# EAGLE design multiout4 (EAGLE 4.16)

## Sheet 1 of 2
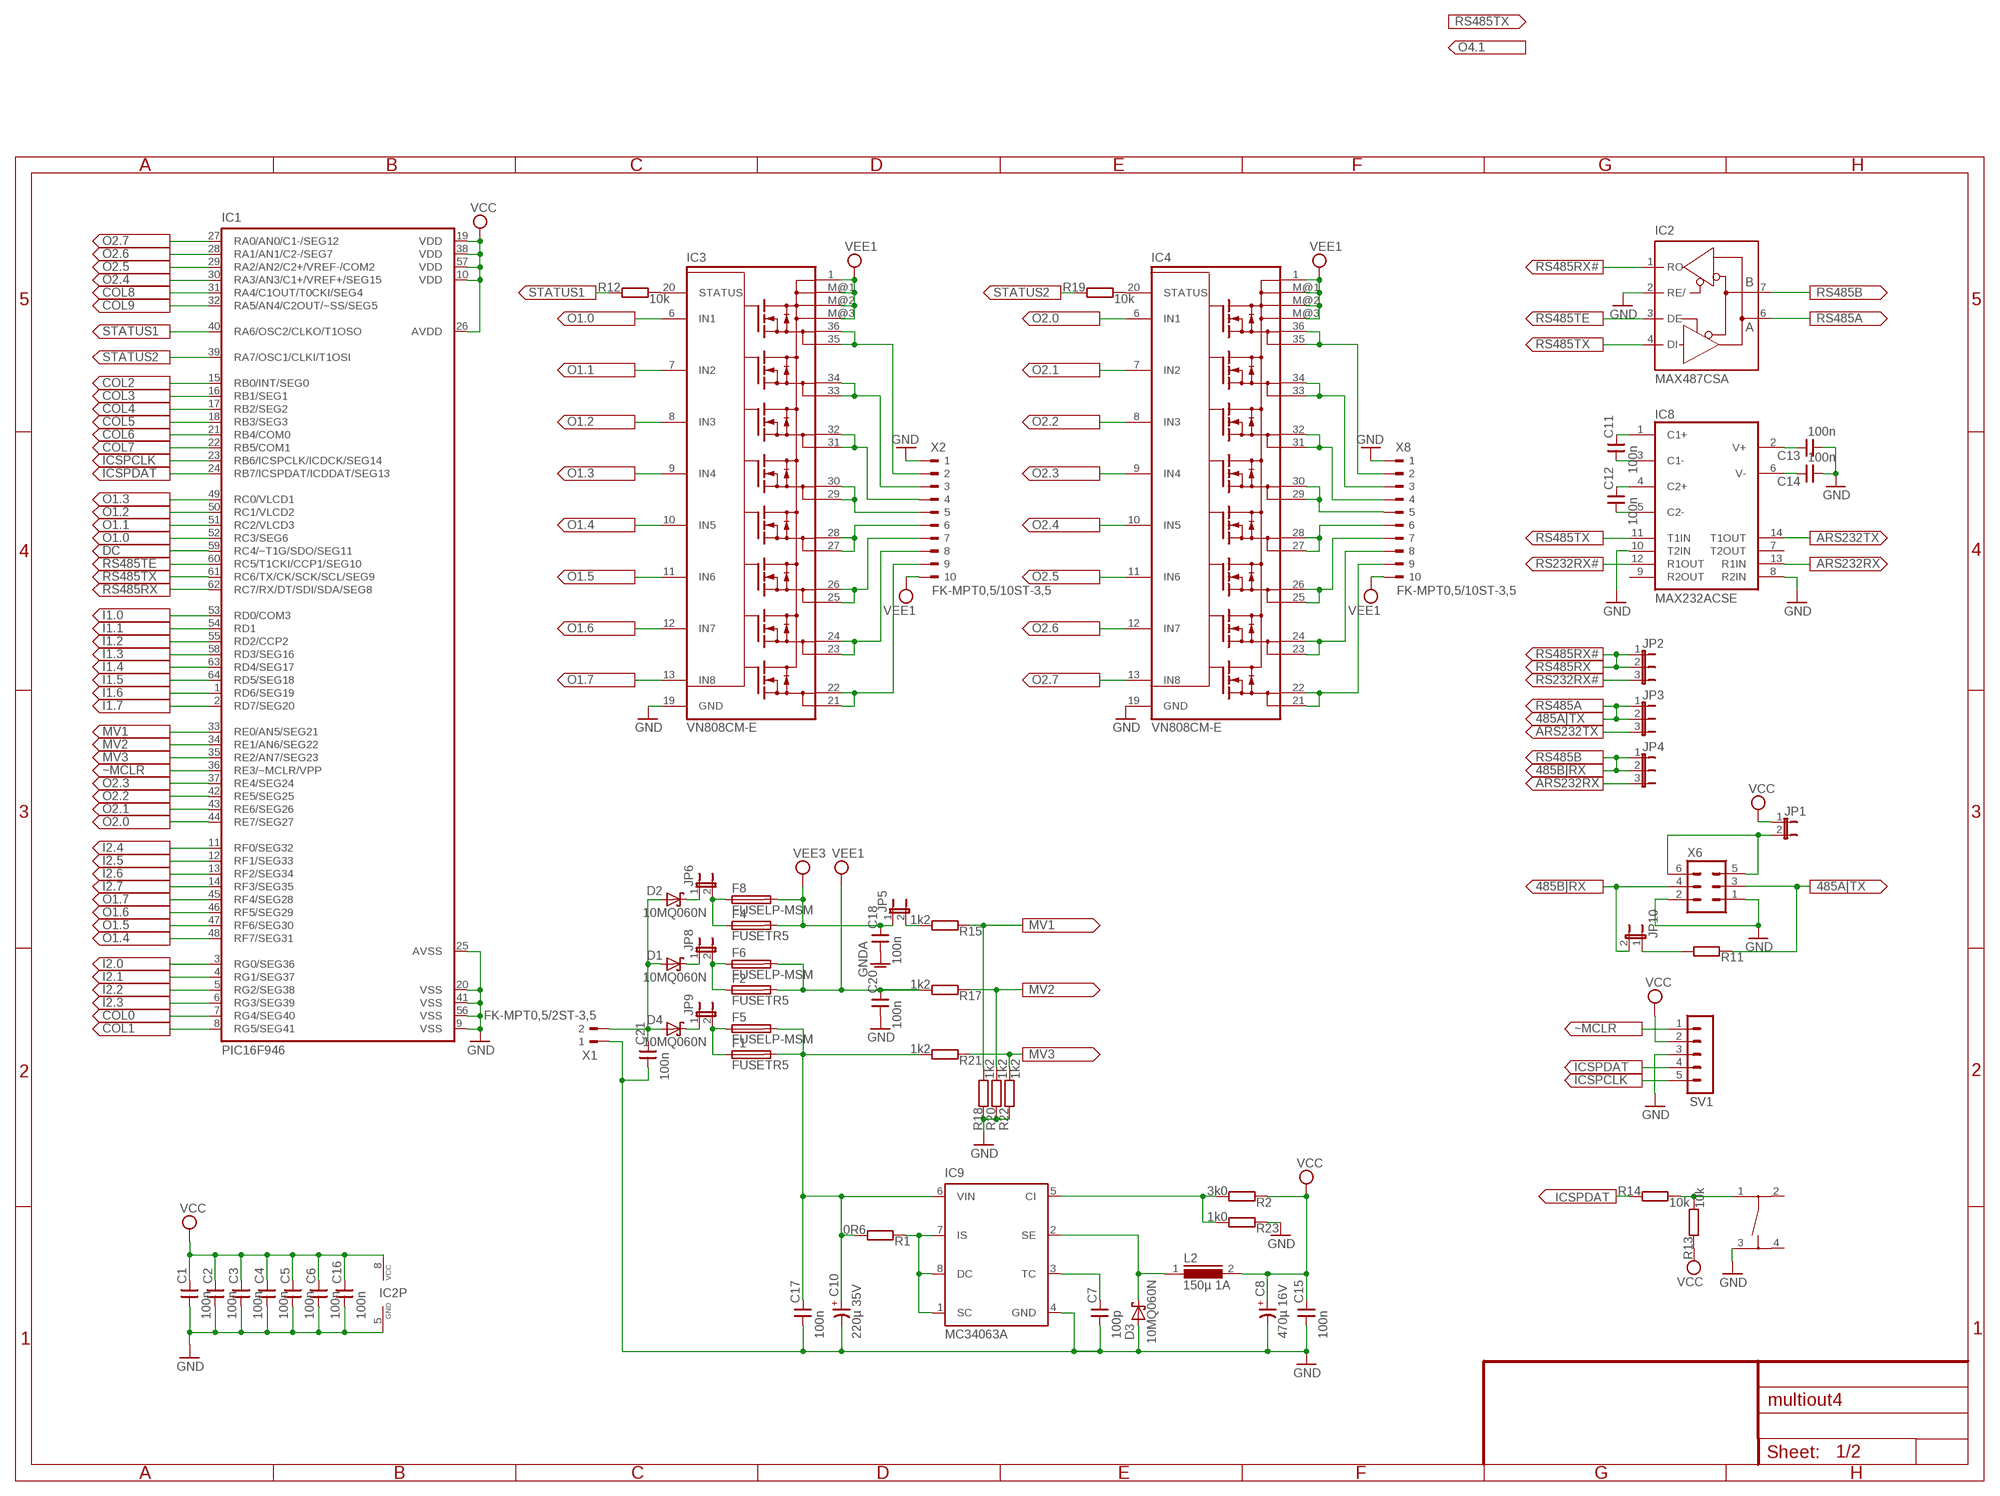
[diagram p0: schematic, sheet 1]

### Parts
C1  100n  CNP-1206  [1206]
C2  100n  CNP-1206  [1206]
C3  100n  CNP-1206  [1206]
C4  100n  CNP-1206  [1206]
C5  100n  CNP-1206  [1206]
C6  100n  CNP-1206  [1206]
C7  100p  CNP-0805  [0805]
C8  470µ 16V  CP-E-035X080  [E-035X080]
C10  220µ 35V  CP-E-035X080  [E-035X080]
C11  100n  CNP-1206  [1206]
C12  100n  CNP-1206  [1206]
C13  100n  CNP-1206  [1206]
C14  100n  CNP-1206  [1206]
C15  100n  CNP-1206  [1206]
C16  100n  CNP-1206  [1206]
C17  100n  CNP-1206  [1206]
C18  100n  CNP-1206  [1206]
C20  100n  CNP-1206  [1206]
C21  100n  CNP-1206  [1206]
D1  10MQ060N  SCHOTTKY-DIODESMA  [SMA]
D2  10MQ060N  SCHOTTKY-DIODESMA  [SMA]
D3  10MQ060N  SCHOTTKY-DIODESMA  [SMA]
D4  10MQ060N  SCHOTTKY-DIODESMA  [SMA]
F1  FUSETR5  [TR5]
F2  FUSETR5  [TR5]
F4  FUSETR5  [TR5]
F5  FUSELP-MSM  [LP-MSM]
F6  FUSELP-MSM  [LP-MSM]
F8  FUSELP-MSM  [LP-MSM]
IC1  PIC16F946  [TQFP64_10X10]
IC2  MAX487CSA  MAX481CSA  [SO08]
IC3  VN808CM-E  [PSO36]
IC4  VN808CM-E  [PSO36]
IC8  MAX232ACSE  [SO16]
IC9  MC34063A  LM34063AS08  [SO08]
JP1  JP1EI  [JP1]
JP2  JP2ES  [SJ_2]
JP3  JP2ES  [SJ_2]
JP4  JP2ES  [SJ_2]
JP5  JP1EI  [JP1]
JP6  JP1EI  [JP1]
JP8  JP1EI  [JP1]
JP9  JP1EI  [JP1]
JP10  JP1EI  [JP1]
L2  150µ 1A  PISM  [PISM]
R1  0R6  R-EU_R0805  [R0805]
R2  3k0  R-EU_R0805  [R0805]
R11  R-EU_R0805  [R0805]
R12  10k  R-EU_R0805  [R0805]
R13  10k  R-EU_R0805  [R0805]
R14  10k  R-EU_R0805  [R0805]
R15  1k2  R-EU_R0805  [R0805]
R17  1k2  R-EU_R0805  [R0805]
R18  1k2  R-EU_R0805  [R0805]
R19  10k  R-EU_R0805  [R0805]
R20  1k2  R-EU_R0805  [R0805]
R21  1k2  R-EU_R0805  [R0805]
R22  1k2  R-EU_R0805  [R0805]
R23  1k0  R-EU_R0805  [R0805]
SV1  MA05-1  [MA05-1]
U$3  MENTOR1254  [1254.1004]
X1  FK-MPT0,5/2ST-3,5  [FK-MPT0,5/2ST-3,5]
X2  FK-MPT0,5/10ST-3,5  [FK-MPT0,5/10ST-3,5]
X6  ML6  [ML6]
X8  FK-MPT0,5/10ST-3,5  [FK-MPT0,5/10ST-3,5]

### Nets
ARS232RX: IC8.13(R1IN) JP4.3
ARS232TX: IC8.14(T1OUT) JP3.3
COL0: IC1.7(RG4/SEG40) ; also sheet 2
COL1: IC1.8(RG5/SEG41) ; also sheet 2
COL2: IC1.15(RB0/INT/SEG0) ; also sheet 2
COL3: IC1.16(RB1/SEG1) ; also sheet 2
COL4: IC1.17(RB2/SEG2) ; also sheet 2
COL5: IC1.18(RB3/SEG3) ; also sheet 2
COL6: IC1.21(RB4/COM0) ; also sheet 2
COL7: IC1.22(RB5/COM1) ; also sheet 2
COL8: IC1.31(RA4/C1OUT/T0CKI/SEG4) ; also sheet 2
COL9: IC1.32(RA5/AN4/C2OUT/~SS/SEG5) ; also sheet 2
DC: IC1.59(RC4/~T1G/SDO/SEG11) ; also sheet 2
GND: C1.P$1 C2.P$1 C3.P$1 C4.P$1 C5.P$1 C6.P$1 C7.1 C8.- C10.- C13.P$1 C14.P$1 C15.P$1 C16.P$1 C17.P$1 C20.P$1 C21.P$1 D3.A IC1.9(VSS) IC1.20(VSS) IC1.25(AVSS) IC1.41(VSS) IC1.56(VSS) IC2.2(RE/) IC2.5(GND) IC3.19(GND) IC4.19(GND) IC8.8(R2IN) IC8.10(T2IN) IC9.4(GND) R18.1 R20.1 R22.1 R23.1 SV1.3 U$3.3(A) X1.1 X2.1 X6.1 X6.2 X8.1 ; also sheet 2
GNDA: C18.P$1 ; also sheet 2
I1.0: IC1.53(RD0/COM3) ; also sheet 2
I1.1: IC1.54(RD1) ; also sheet 2
I1.2: IC1.55(RD2/CCP2) ; also sheet 2
I1.3: IC1.58(RD3/SEG16) ; also sheet 2
I1.4: IC1.63(RD4/SEG17) ; also sheet 2
I1.5: IC1.64(RD5/SEG18) ; also sheet 2
I1.6: IC1.1(RD6/SEG19) ; also sheet 2
I1.7: IC1.2(RD7/SEG20) ; also sheet 2
I2.0: IC1.3(RG0/SEG36) ; also sheet 2
I2.1: IC1.4(RG1/SEG37) ; also sheet 2
I2.2: IC1.5(RG2/SEG38) ; also sheet 2
I2.3: IC1.6(RG3/SEG39) ; also sheet 2
I2.4: IC1.11(RF0/SEG32) ; also sheet 2
I2.5: IC1.12(RF1/SEG33) ; also sheet 2
I2.6: IC1.13(RF2/SEG34) ; also sheet 2
I2.7: IC1.14(RF3/SEG35) ; also sheet 2
ICSPCLK: IC1.23(RB6/ICSPCLK/ICDCK/SEG14) SV1.5 ; also sheet 2
ICSPDAT: IC1.24(RB7/ICSPDAT/ICDDAT/SEG13) R14.1 SV1.4
MV1: IC1.33(RE0/AN5/SEG21) R15.1 R18.2
MV2: IC1.34(RE1/AN6/SEG22) R17.1 R20.2
MV3: IC1.35(RE2/AN7/SEG23) R21.1 R22.2
N$3: IC3.35(OUT1) IC3.36(OUT1) X2.2
N$17: D2.C JP6.1
N$18: D1.C JP8.1
N$19: D4.C JP9.1
N$20: JP5.2 R15.2
N$27: IC3.33(OUT2) IC3.34(OUT2) X2.3
N$28: IC3.31(OUT3) IC3.32(OUT3) X2.4
N$30: IC3.27(OUT5) IC3.28(OUT5) X2.6
N$31: IC3.25(OUT6) IC3.26(OUT6) X2.7
N$32: IC3.23(OUT7) IC3.24(OUT7) X2.8
N$39: IC4.35(OUT1) IC4.36(OUT1) X8.2
N$40: IC4.33(OUT2) IC4.34(OUT2) X8.3
N$41: IC4.31(OUT3) IC4.32(OUT3) X8.4
N$42: IC4.29(OUT4) IC4.30(OUT4) X8.5
N$43: IC4.27(OUT5) IC4.28(OUT5) X8.6
N$44: IC4.25(OUT6) IC4.26(OUT6) X8.7
N$45: IC4.23(OUT7) IC4.24(OUT7) X8.8
N$46: IC4.21(OUT8) IC4.22(OUT8) X8.9
N$47: IC3.21(OUT8) IC3.22(OUT8) X2.9
N$53: R13.2 R14.2 U$3.1(B)
N$54: IC3.20(STATUS) R12.2
N$58: IC4.20(STATUS) R19.2
N$59: C7.2 IC9.3(TC)
N$60: C10.+ C17.P$2 F1.2 F5.2 IC9.6(VIN) R1.2 R21.2
N$61: IC9.1(SC) IC9.7(IS) IC9.8(DC) R1.1
N$62: D3.C IC9.2(SE) L2.1
N$63: IC9.5(CI) R2.2 R23.2
N$72: F4.1 F8.1 JP6.2
N$73: IC3.29(OUT4) IC3.30(OUT4) X2.5
N$74: C12.P$1 IC8.5(C2-)
N$76: C12.P$2 IC8.4(C2+)
N$77: C11.P$1 IC8.3(C1-)
N$80: C11.P$2 IC8.1(C1+)
N$81: C13.P$2 IC8.2(V+)
N$82: C14.P$2 IC8.6(V-)
N$85: F2.1 F6.1 JP8.2
N$90: JP1.2 X6.5 X6.6
N$98: F1.1 F5.1 JP9.2
N$99: C21.P$2 D1.A D2.A D4.A X1.2
N$116: JP10.1 R11.2
O1.0: IC1.52(RC3/SEG6) IC3.6(IN1)
O1.1: IC1.51(RC2/VLCD3) IC3.7(IN2)
O1.2: IC1.50(RC1/VLCD2) IC3.8(IN3)
O1.3: IC1.49(RC0/VLCD1) IC3.9(IN4)
O1.4: IC1.48(RF7/SEG31) IC3.10(IN5)
O1.5: IC1.47(RF6/SEG30) IC3.11(IN6)
O1.6: IC1.46(RF5/SEG29) IC3.12(IN7)
O1.7: IC1.45(RF4/SEG28) IC3.13(IN8)
O2.0: IC1.44(RE7/SEG27) IC4.6(IN1)
O2.1: IC1.43(RE6/SEG26) IC4.7(IN2)
O2.2: IC1.42(RE5/SEG25) IC4.8(IN3)
O2.3: IC1.37(RE4/SEG24) IC4.9(IN4)
O2.4: IC1.30(RA3/AN3/C1+/VREF+/SEG15) IC4.10(IN5)
O2.5: IC1.29(RA2/AN2/C2+/VREF-/COM2) IC4.11(IN6)
O2.6: IC1.28(RA1/AN1/C2-/SEG7) IC4.12(IN7)
O2.7: IC1.27(RA0/AN0/C1-/SEG12) IC4.13(IN8)
RS232RX#: IC8.12(R1OUT) JP2.3
RS485A: IC2.6(A) JP3.1 JP3.2 R11.1 X6.3
RS485B: IC2.7(B) JP4.1 JP4.2 JP10.2 X6.4
RS485RX: IC1.62(RC7/RX/DT/SDI/SDA/SEG8) IC2.1(RO) JP2.1 JP2.2
RS485TE: IC1.60(RC5/T1CKI/CCP1/SEG10) IC2.3(DE)
RS485TX: IC1.61(RC6/TX/CK/SCK/SCL/SEG9) IC2.4(DI) IC8.11(T1IN)
STATUS1: IC1.40(RA6/OSC2/CLKO/T1OSO) R12.1
STATUS2: IC1.39(RA7/OSC1/CLKI/T1OSI) R19.1
VCC: C1.P$2 C2.P$2 C3.P$2 C4.P$2 C5.P$2 C6.P$2 C8.+ C15.P$2 C16.P$2 IC1.10(VDD) IC1.19(VDD) IC1.26(AVDD) IC1.38(VDD) IC1.57(VDD) IC2.8(VCC) JP1.1 L2.2 R2.1 R13.1 SV1.2 ; also sheet 2
VEE1: C20.P$2 F2.2 F6.2 IC3.1(VBB) IC3.M@1(VBB) IC3.M@2(VBB) IC3.M@3(VBB) IC4.1(VBB) IC4.M@1(VBB) IC4.M@2(VBB) IC4.M@3(VBB) R17.2 X2.10 X8.10
VEE3: C18.P$2 F4.2 F8.2 JP5.1 ; also sheet 2
~MCLR: IC1.36(RE3/~MCLR/VPP) SV1.1
Unconnected: IC8.7(T2OUT) IC8.9(R2OUT) U$3.2(B) U$3.4(A)

## Sheet 2 of 2
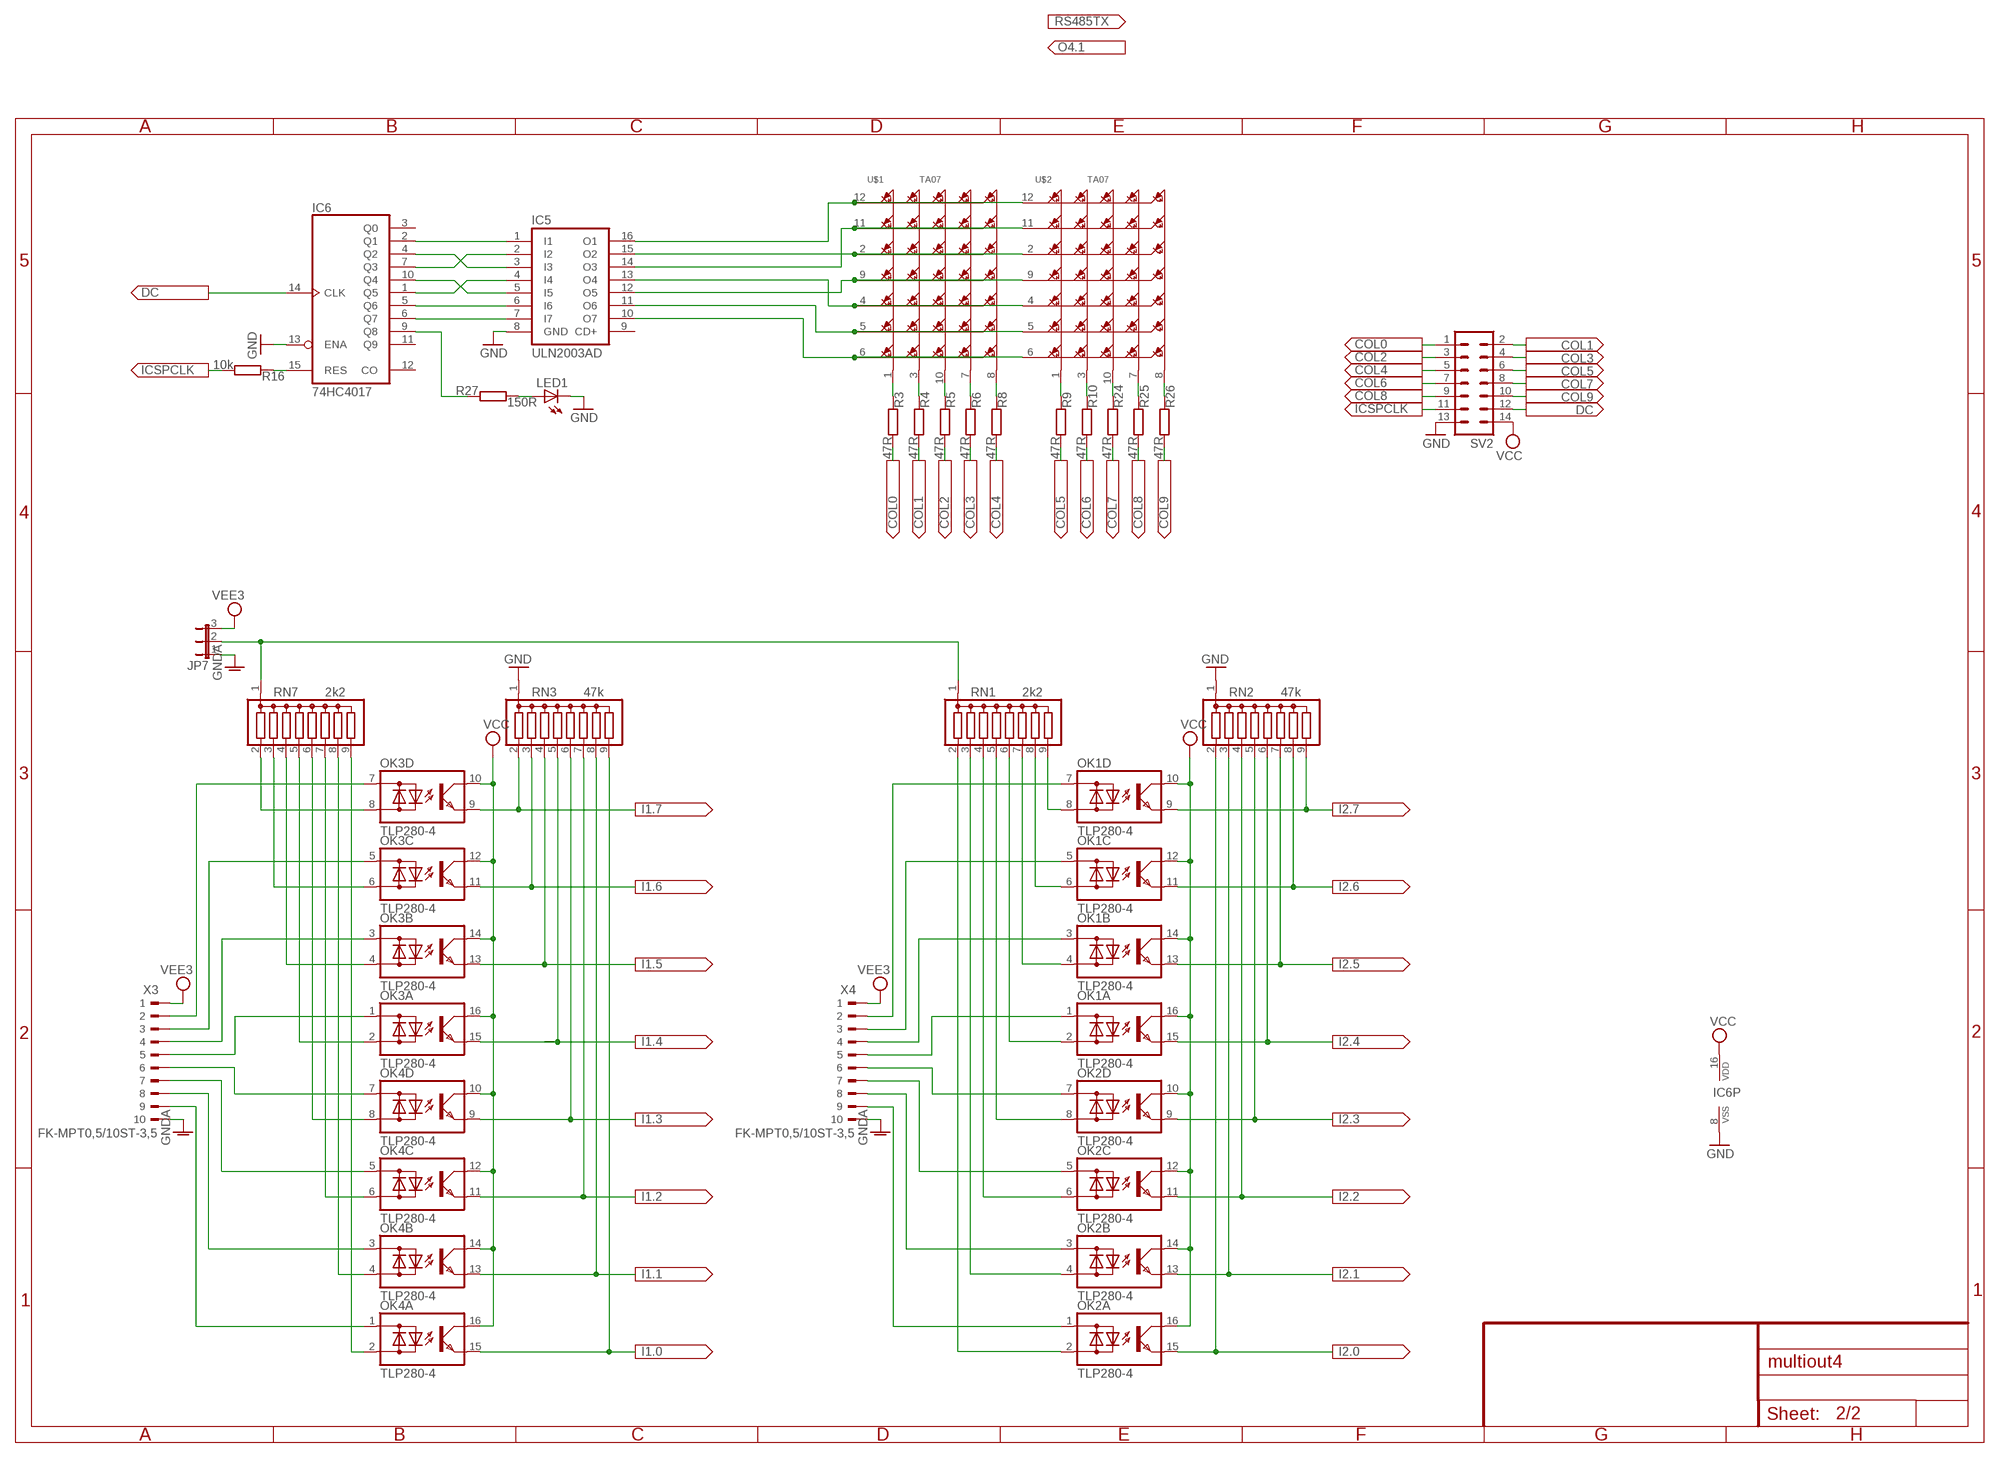
[diagram p1: schematic, sheet 2]

### Parts
IC5  ULN2003AD  [SO16]
IC6  74HC4017  4017D  [SO16]
JP7  JP2EI  [JP2]
LED1  LED3MM  [LED3MM]
OK1  TLP280-4  [MINI-FLAT-16]
OK2  TLP280-4  [MINI-FLAT-16]
OK3  TLP280-4  [MINI-FLAT-16]
OK4  TLP280-4  [MINI-FLAT-16]
R3  47R  R-EU_R0805  [R0805]
R4  47R  R-EU_R0805  [R0805]
R5  47R  R-EU_R0805  [R0805]
R6  47R  R-EU_R0805  [R0805]
R8  47R  R-EU_R0805  [R0805]
R9  47R  R-EU_R0805  [R0805]
R10  47R  R-EU_R0805  [R0805]
R16  10k  R-EU_R0805  [R0805]
R24  47R  R-EU_R0805  [R0805]
R25  47R  R-EU_R0805  [R0805]
R26  47R  R-EU_R0805  [R0805]
R27  150R  R-EU_R0805  [R0805]
RN1  2k2  G08R  [SIL9]
RN2  47k  G08R  [SIL9]
RN3  47k  G08R  [SIL9]
RN7  2k2  G08R  [SIL9]
SV2  MA07-2  [MA07-2]
U$1  TA07  [DOTMATRIX5X7]
U$2  TA07  [DOTMATRIX5X7]
X3  FK-MPT0,5/10ST-3,5  [FK-MPT0,5/10ST-3,5]
X4  FK-MPT0,5/10ST-3,5  [FK-MPT0,5/10ST-3,5]

### Nets
CA0: R3.1 U$1.1(+C1)
CA1: R4.1 U$1.3(+C2)
CA2: R5.1 U$1.10(+C3)
CA3: R6.1 U$1.7(+C4)
CA4: R8.1 U$1.8(+C5)
CA5: R9.1 U$2.1(+C1)
CA6: R10.1 U$2.3(+C2)
CA7: R24.1 U$2.10(+C3)
CA8: R25.1 U$2.7(+C4)
CA9: R26.1 U$2.8(+C5)
COL0: R3.2 SV2.1 ; also sheet 1
COL1: R4.2 SV2.2 ; also sheet 1
COL2: R5.2 SV2.3 ; also sheet 1
COL3: R6.2 SV2.4 ; also sheet 1
COL4: R8.2 SV2.5 ; also sheet 1
COL5: R9.2 SV2.6 ; also sheet 1
COL6: R10.2 SV2.7 ; also sheet 1
COL7: R24.2 SV2.8 ; also sheet 1
COL8: R25.2 SV2.9 ; also sheet 1
COL9: R26.2 SV2.10 ; also sheet 1
DC: IC6.14(CLK) SV2.12 ; also sheet 1
GND: IC5.8(GND) IC6.8(VSS) IC6.13(ENA) LED1.K(C) RN2.1 RN3.1 SV2.13 ; also sheet 1
GNDA: JP7.1 X3.10 X4.10 ; also sheet 1
I1.0: OK4.15(A:E) RN3.9 ; also sheet 1
I1.1: OK4.13(B:E) RN3.8 ; also sheet 1
I1.2: OK4.11(C:E) RN3.7 ; also sheet 1
I1.3: OK4.9(D:E) RN3.6 ; also sheet 1
I1.4: OK3.15(A:E) RN3.5 ; also sheet 1
I1.5: OK3.13(B:E) RN3.4 ; also sheet 1
I1.6: OK3.11(C:E) RN3.3 ; also sheet 1
I1.7: OK3.9(D:E) RN3.2 ; also sheet 1
I2.0: OK2.15(A:E) RN2.2 ; also sheet 1
I2.1: OK2.13(B:E) RN2.3 ; also sheet 1
I2.2: OK2.11(C:E) RN2.4 ; also sheet 1
I2.3: OK2.9(D:E) RN2.5 ; also sheet 1
I2.4: OK1.15(A:E) RN2.6 ; also sheet 1
I2.5: OK1.13(B:E) RN2.7 ; also sheet 1
I2.6: OK1.11(C:E) RN2.8 ; also sheet 1
I2.7: OK1.9(D:E) RN2.9 ; also sheet 1
ICSPCLK: R16.2 SV2.11 ; also sheet 1
N$5: IC5.16(O1) U$1.12(-R1) U$2.12(-R1)
N$7: IC5.14(O3) U$1.11(-R2) U$2.11(-R2)
N$8: IC5.15(O2) U$1.2(-R3) U$2.2(-R3)
N$9: IC5.12(O5) U$1.9(-R4) U$2.9(-R4)
N$10: IC5.13(O4) U$1.4(-R5) U$2.4(-R5)
N$11: IC5.11(O6) U$1.5(-R6) U$2.5(-R6)
N$12: IC5.10(O7) U$1.6(-R7) U$2.6(-R7)
N$13: IC5.4(I4) IC6.1(Q5)
N$14: IC5.5(I5) IC6.10(Q4)
N$15: IC5.2(I2) IC6.7(Q3)
N$16: IC5.3(I3) IC6.4(Q2)
N$21: LED1.A R27.2
N$23: OK2.8(D:AC2) RN1.5
N$24: OK2.6(C:AC2) RN1.4
N$25: OK2.4(B:AC2) RN1.3
N$26: OK2.2(A:AC2) RN1.2
N$29: OK3.8(D:AC2) RN7.2
N$33: OK3.6(C:AC2) RN7.3
N$34: OK3.4(B:AC2) RN7.4
N$35: OK1.7(D:AC1) X4.2
N$36: OK1.5(C:AC1) X4.3
N$37: OK1.3(B:AC1) X4.4
N$38: OK1.1(A:AC1) X4.5
N$48: IC6.9(Q8) R27.1
N$50: IC5.1(I1) IC6.2(Q1)
N$55: IC5.6(I6) IC6.5(Q6)
N$56: IC5.7(I7) IC6.6(Q7)
N$57: IC6.15(RES) R16.1
N$64: JP7.2 RN1.1 RN7.1
N$66: OK3.2(A:AC2) RN7.5
N$67: OK4.8(D:AC2) RN7.6
N$68: OK4.6(C:AC2) RN7.7
N$69: OK4.4(B:AC2) RN7.8
N$71: OK4.2(A:AC2) RN7.9
N$86: OK2.1(A:AC1) X4.9
N$87: OK2.3(B:AC1) X4.8
N$88: OK2.5(C:AC1) X4.7
N$89: OK2.7(D:AC1) X4.6
N$100: OK3.7(D:AC1) X3.2
N$101: OK4.1(A:AC1) X3.9
N$102: OK4.3(B:AC1) X3.8
N$103: OK3.5(C:AC1) X3.3
N$104: OK4.5(C:AC1) X3.7
N$105: OK3.3(B:AC1) X3.4
N$106: OK3.1(A:AC1) X3.5
N$107: OK4.7(D:AC1) X3.6
N$108: OK1.8(D:AC2) RN1.9
N$109: OK1.6(C:AC2) RN1.8
N$110: OK1.4(B:AC2) RN1.7
N$111: OK1.2(A:AC2) RN1.6
VCC: IC6.16(VDD) OK1.10(D:C) OK1.12(C:C) OK1.14(B:C) OK1.16(A:C) OK2.10(D:C) OK2.12(C:C) OK2.14(B:C) OK2.16(A:C) OK3.10(D:C) OK3.12(C:C) OK3.14(B:C) OK3.16(A:C) OK4.10(D:C) OK4.12(C:C) OK4.14(B:C) OK4.16(A:C) SV2.14 ; also sheet 1
VEE3: JP7.3 X3.1 X4.1 ; also sheet 1
Unconnected: IC5.9(CD+) IC6.3(Q0) IC6.11(Q9) IC6.12(CO)

## Power pins joined to a net without a drawn wire
GND: IC8.15(GND)
VCC: IC8.16(VCC)

## Library data of the parts
C1-C7 C11-C18 C20 C21 = cap-master:CNP-: NON-POLARIZED CAP
C8 C10 = cap-master:CP-: POLARIZED CAP
D1-D4 = diode:SCHOTTKY-DIODE: Schottky Diode
F1 F2 F4-F6 F8 = fuse:FUSE: Fuse
IC1 = pic16F946:PIC16F946
IC2 = maxim:MAX481CSA: RS485 TRANSEIVER
IC3 IC4 = vn808cm-e:VN808CM-E
IC5 = uln-udn:ULN2003A: DRIVER ARRAY
IC6 = 40xx:4017: COUNTER/DIVIDER
IC8 = maxim:MAX232A: RS232 TRANSEIVER
IC9 = L4971:LM34063A
JP1 JP5 JP6 JP8-JP10 = jumper:JP1E: JUMPER
JP2-JP4 JP7 = jumper:JP2E: JUMPER
L2 = inductors:PI: INDUCTOR
LED1 = led:LED: LED OSRAM: - CHIPLED LG R971, LG N971, LY N971, LG Q971, LY Q971, LO R971, LY R971 LH N974, LH R974 LS Q976, LO Q976, LY Q976 LO Q996 - Hyper CHIPLED LW Q18S LB Q993, LB Q99A, LB R99A - SideLED LS A670, LO A670, LY A670, LG A670, LP A670 LB A673, LV A673, LT A673, LW A673 LH A674 LY A675 LS A676, LA A676, LO A676, LY A676, LW A676 LS A679, LY A679, LG A679 - Hyper Micro SIDELED® LS Y876, LA Y876, LO Y876, LY Y876 LT Y87S - SmartLED LW L88C, LW L88S LB L89C, LB L89S, LG L890 LS L89K, LO L89K, LY L89K LS L896, LA L896, LO L896, LY L896 - TOPLED LS T670, LO T670, LY T670, LG T670, LP T670 LSG T670, LSP T670, LSY T670, LOP T670, LYG T670 LG T671, LOG T671, LSG T671 LB T673, LV T673, LT T673, LW T673 LH T674 LS T676, LA T676, LO T676, LY T676, LB T676, LH T676, LSB T676, LW T676 LB T67C, LV T67C, LT T67C, LS T67K, LO T67K, LY T67K, LW E67C LS E67B, LA E67B, LO E67B, LY E67B, LB E67C, LV E67C, LT E67C LW T67C LS T679, LY T679, LG T679 LS T770, LO T770, LY T770, LG T770, LP T770 LB T773, LV T773, LT T773, LW T773 LH T774 LS E675, LA E675, LY E675, LS T675 LS T776, LA T776, LO T776, LY T776, LB T776 LHGB T686 LT T68C, LB T68C - Hyper Mini TOPLED® LB M676 - Mini TOPLED Santana® LG M470 LS M47K, LO M47K, LY M47K Source: http://www.osram.convergy.de - LUMILED® LXK2-PW12-R00, LXK2-PW12-S00, LXK2-PW14-U00, LXK2-PW14-V00 LXK2-PM12-R00, LXK2-PM12-S00, LXK2-PM14-U00 LXK2-PE12-Q00, LXK2-PE12-R00, LXK2-PE12-S00, LXK2-PE14-T00, LXK2-PE14-U00 LXK2-PB12-K00, LXK2-PB12-L00, LXK2-PB12-M00, LXK2-PB14-N00, LXK2-PB14-P00, LXK2-PB14-Q00 LXK2-PR12-L00, LXK2-PR12-M00, LXK2-PR14-Q00, LXK2-PR14-R00 LXK2-PD12-Q00, LXK2-PD12-R00, LXK2-PD12-S00 LXK2-PH12-R00, LXK2-PH12-S00 LXK2-PL12-P00, LXK2-PL12-Q00, LXK2-PL12-R00 Source: www.luxeon.com
OK1-OK4 = optocoupler:TLP280-4: TEXAS INSTRUMENTS OPTO COUPLER
R1-R6 R8-R27 = rcl:R-EU_: RESISTOR, European symbol
RN1-RN3 RN7 = resistor-sil:G08R: SIL RESISTOR
SV1 = con-lstb:MA05-1: PIN HEADER
SV2 = con-lstb:MA07-2: PIN HEADER
U$1 U$2 = led:TA07
U$3 = switch:MENTOR1254
X1 = con-phoenix-fkmpt35:FK-MPT0,5/2ST-3,5
X2-X4 X8 = con-phoenix-fkmpt35:FK-MPT0,5/10ST-3,5
X6 = con-harting-ml:ML6: HARTING

## Board
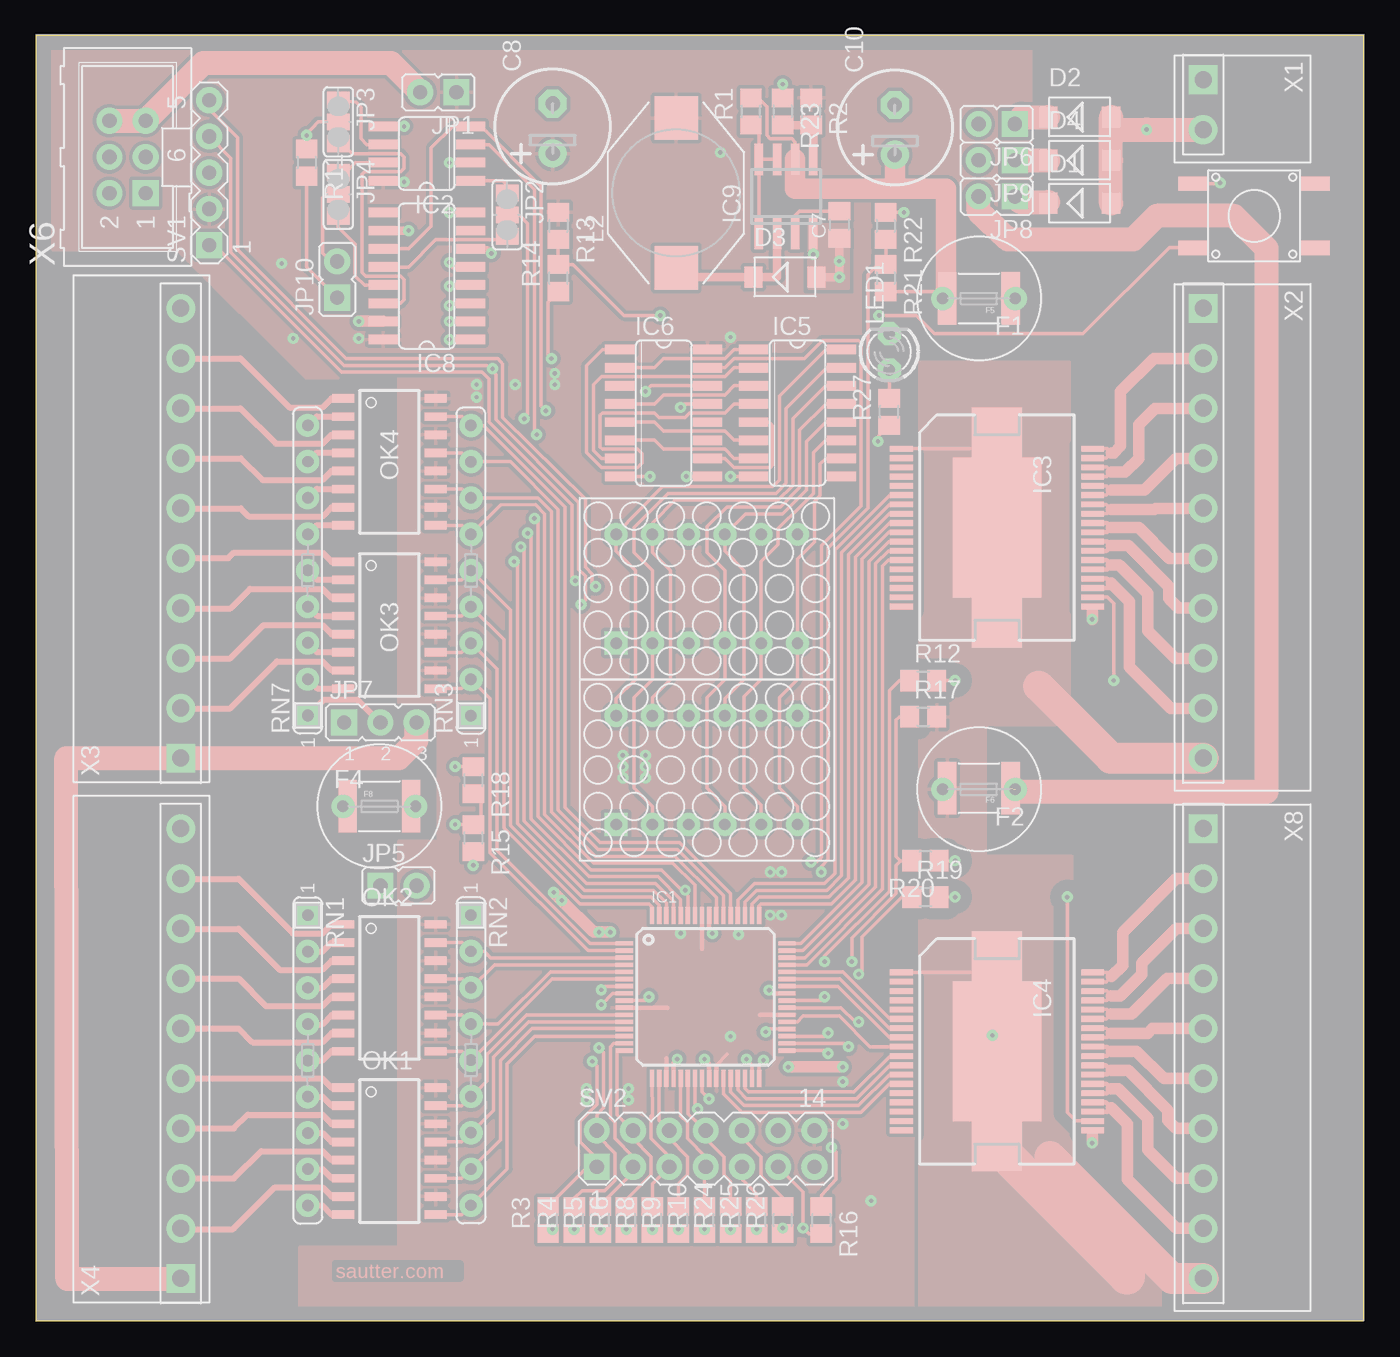
[diagram p2: board, top side]
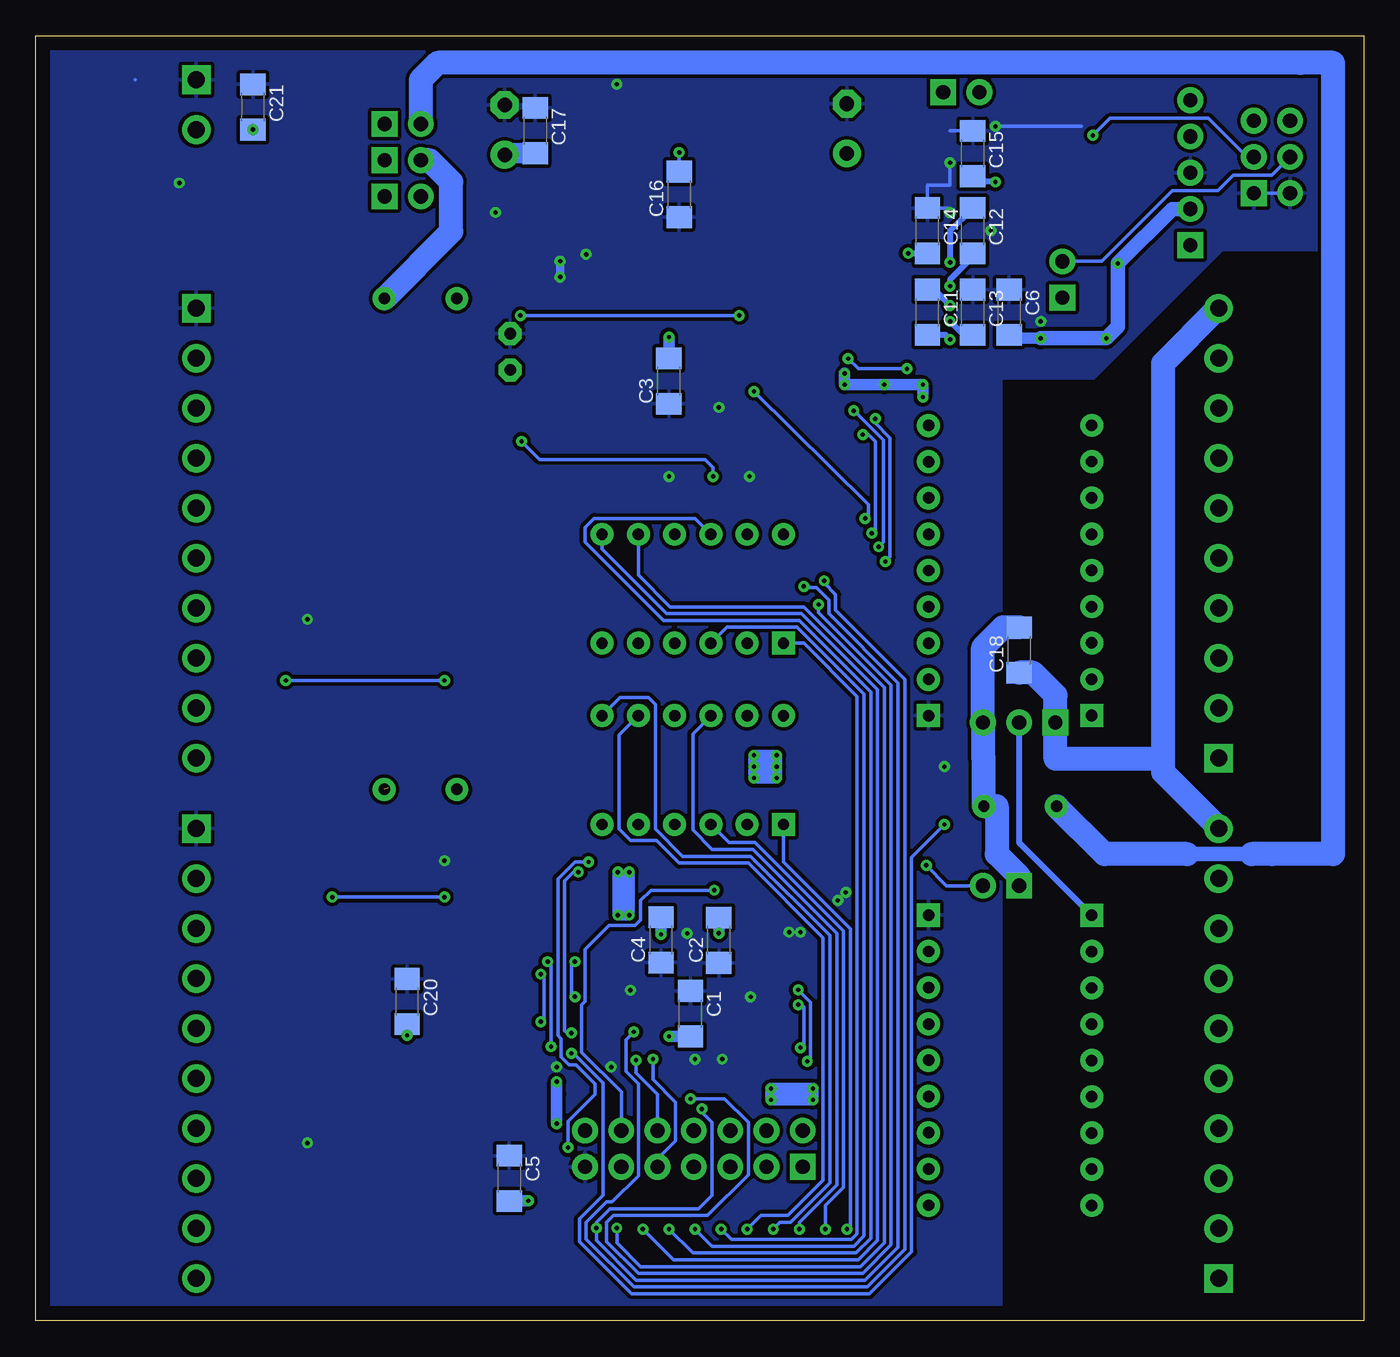
[diagram p3: board, bottom side, seen from below]

Size 93 x 90 mm. Coordinates in mm from the lower left corner, seen from the top.
Outline: 0,90 0,0 93,0 93,90 0,90
Copper layers (1*16): Top 0.035mm / dielectric 1.5mm / Bottom 0.035mm
Design rules "default": minimum track width 6mil, minimum drill 0.3mm, track to track 6mil, track to pad 6mil, pad to pad 6mil, via to via 6mil, smd to smd 0mil, copper to edge 40mil, drill to drill 8mil, minimum pad ring 0.4mm, minimum via ring 9mil, stop-mask expansion 6mil, vias tented up to drill 13mil, thermal gap 10mil

### Footprints (pad centres in the part's own frame; a part is rotated, then mirrored left to right if it is on the bottom)
1206 = smd 1.524 x 1.778: P$1 -1.587,0; P$2 1.587,0
0805 = smd 1.27 x 1.524: 1 -0.953,0; 2 0.953,0
E-035X080 = drill 1.016 pad 1.93 round: + -1.905,0 | drill 1.016 pad 1.93 octagon: - 1.587,0
SMA = smd 1.27 x 1.473: A 2.2,0; C -2.2,0
TR5 = drill 0.8 pad 1.6 round: 1 -2.54,0; 2 2.54,0
LP-MSM = smd 1.27 x 3.683: 1 -2.222,0; 2 2.223,0
TQFP64_10X10 = smd 1.2 x 0.3: 1 -5.7,3.75; 2 -5.7,3.25; 3 -5.7,2.75; 4 -5.7,2.25; 5 -5.7,1.75; 6 -5.7,1.25; 7 -5.7,0.75; 8 -5.7,0.25; 9 -5.7,-0.25; 10 -5.7,-0.75; 11 -5.7,-1.25; 12 -5.7,-1.75; 13 -5.7,-2.25; 14 -5.7,-2.75; 15 -5.7,-3.25; 16 -5.7,-3.75; 33 5.7,-3.75; 34 5.7,-3.25; 35 5.7,-2.75; 36 5.7,-2.25; 37 5.7,-1.75; 38 5.7,-1.25; 39 5.7,-0.75; 40 5.7,-0.25; 41 5.7,0.25; 42 5.7,0.75; 43 5.7,1.25; 44 5.7,1.75; 45 5.7,2.25; 46 5.7,2.75; 47 5.7,3.25; 48 5.7,3.75 | smd 0.3 x 1.2: 17 -3.75,-5.7; 18 -3.25,-5.7; 19 -2.75,-5.7; 20 -2.25,-5.7; 21 -1.75,-5.7; 22 -1.25,-5.7; 23 -0.75,-5.7; 24 -0.25,-5.7; 25 0.25,-5.7; 26 0.75,-5.7; 27 1.25,-5.7; 28 1.75,-5.7; 29 2.25,-5.7; 30 2.75,-5.7; 31 3.25,-5.7; 32 3.75,-5.7; 49 3.75,5.7; 50 3.25,5.7; 51 2.75,5.7; 52 2.25,5.7; 53 1.75,5.7; 54 1.25,5.7; 55 0.75,5.7; 56 0.25,5.7; 57 -0.25,5.7; 58 -0.75,5.7; 59 -1.25,5.7; 60 -1.75,5.7; 61 -2.25,5.7; 62 -2.75,5.7; 63 -3.25,5.7; 64 -3.75,5.7
SO08 = smd 0.66 x 2.032: 1 -1.905,-3.073; 2 -0.635,-3.073; 3 0.635,-3.073; 4 1.905,-3.073; 5 1.905,3.073; 6 0.635,3.073; 7 -0.635,3.073; 8 -1.905,3.073
PSO36 = smd 0.4 x 1.6: 1 -5.525,-6.7; 2 -4.875,-6.7; 3 -4.225,-6.7; 4 -3.575,-6.7; 5 -2.925,-6.7; 6 -2.275,-6.7; 7 -1.625,-6.7; 8 -0.975,-6.7; 9 -0.325,-6.7; 10 0.325,-6.7; 11 0.975,-6.7; 12 1.625,-6.7; 13 2.275,-6.7; 14 2.925,-6.7; 15 3.575,-6.7; 16 4.225,-6.7; 17 4.875,-6.7; 18 5.525,-6.7; 19 5.525,6.7; 20 4.875,6.7; 21 4.225,6.7; 22 3.575,6.7; 23 2.925,6.7; 24 2.275,6.7; 25 1.625,6.7; 26 0.975,6.7; 27 0.325,6.7; 28 -0.325,6.7; 29 -0.975,6.7; 30 -1.625,6.7; 31 -2.275,6.7; 32 -2.925,6.7; 33 -3.575,6.7; 34 -4.225,6.7; 35 -4.875,6.7; 36 -5.525,6.7 | smd 9.8 x 6.2: M@1 0,0 | smd 3.5 x 3.5: M@2 -6.65,0; M@3 6.65,0
SO16 = smd 0.66 x 2.032: 1 -4.445,-3.073; 2 -3.175,-3.073; 3 -1.905,-3.073; 4 -0.635,-3.073; 5 0.635,-3.073; 6 1.905,-3.073; 7 3.175,-3.073; 8 4.445,-3.073; 9 4.445,3.073; 10 3.175,3.073; 11 1.905,3.073; 12 0.635,3.073; 13 -0.635,3.073; 14 -1.905,3.073; 15 -3.175,3.073; 16 -4.445,3.073
SO08' = smd 0.6 x 2.2: 1 -1.905,-2.6; 2 -0.635,-2.6; 3 0.635,-2.6; 4 1.905,-2.6; 5 1.905,2.6; 6 0.635,2.6; 7 -0.635,2.6; 8 -1.905,2.6
JP1 = drill 1 pad 1.6 square: 1 0,-1.27 | drill 1 pad 1.6 round: 2 0,1.27
SJ_2 = smd 1.168 x 1.6: 1 -1.524,0; 2 0,0; 3 1.524,0
JP2 = drill 1 pad 1.6 square: 1 -2.54,0 | drill 1 pad 1.6 round: 2 0,0; 3 2.54,0
PISM = smd 3.048 x 3.048: 1 -5.239,0; 2 5.239,0
LED3MM = drill 0.813 octagon: A -1.27,0; K 1.27,0
MINI-FLAT-16 = smd 1.524 x 0.584: 1 -3.24,4.445; 2 -3.24,3.175; 3 -3.24,1.905; 4 -3.24,0.635; 5 -3.24,-0.635; 6 -3.24,-1.905; 7 -3.24,-3.175; 8 -3.24,-4.445; 9 3.24,-4.445; 10 3.24,-3.175; 11 3.24,-1.905; 12 3.24,-0.635; 13 3.24,0.635; 14 3.24,1.905; 15 3.24,3.175; 16 3.24,4.445
R0805 = smd 1.3 x 1.5: 1 -0.95,0; 2 0.95,0
SIL9 = drill 0.813 pad 1.6 square: 1 -10.16,0 | drill 0.8 pad 1.6 round: 2 -7.62,0; 3 -5.08,0; 4 -2.54,0; 5 0,0; 7 5.08,0; 8 7.62,0; 9 10.16,0 | drill 0.813 pad 1.6 round: 6 2.54,0
MA05-1 = drill 1 pad 1.6 square: 1 -5.08,0 | drill 1 pad 1.6 round: 2 -2.54,0; 3 0,0; 4 2.54,0; 5 5.08,0
MA07-2 = drill 1 pad 1.6 square: 1 -7.62,-1.27 | drill 1 pad 1.6 round: 2 -7.62,1.27; 3 -5.08,-1.27; 4 -5.08,1.27; 5 -2.54,-1.27; 6 -2.54,1.27; 7 0,-1.27; 8 0,1.27; 9 2.54,-1.27; 10 2.54,1.27; 11 5.08,-1.27; 12 5.08,1.27; 13 7.62,-1.27; 14 7.62,1.27
DOTMATRIX5X7 = drill 0.8 pad 1.6 square: 1 -3.81,6.35 | drill 0.8 pad 1.6 round: 2 -3.81,3.81; 3 -3.81,1.27; 4 -3.81,-1.27; 5 -3.81,-3.81; 6 -3.81,-6.35; 7 3.81,-6.35; 8 3.81,-3.81; 9 3.81,-1.27; 10 3.81,1.27; 11 3.81,3.81; 12 3.81,6.35
1254.1004 = smd 2 x 1: 1 -4.3,-2.25; 2 4.3,-2.25; 3 -4.3,2.25; 4 4.3,2.25
FK-MPT0,5/2ST-3,5 = drill 1.2 pad 2 square: 1 -1.75,0 | drill 1.2 pad 2 round: 2 1.75,0
FK-MPT0,5/10ST-3,5 = drill 1.2 pad 2 square: 1 -15.75,0 | drill 1.2 pad 2 round: 2 -12.25,0; 3 -8.75,0; 4 -5.25,0; 5 -1.75,0; 6 1.75,0; 7 5.25,0; 8 8.75,0; 9 12.25,0; 10 15.75,0
ML6 = drill 1 pad 1.6 square: 1 -2.54,-1.27 | drill 1 pad 1.6 round: 2 -2.54,1.27; 3 0,-1.27; 4 0,1.27; 5 2.54,-1.27; 6 2.54,1.27

### Placement (x,y rotation side)
C1  47.15,21.52 270 bottom
C2  45.16,26.66 90 bottom
C3  48.66,65.81 90 bottom
C4  49.21,26.68 90 bottom
C5  59.85,9.99 270 bottom
C6  24.84,70.63 270 bottom
C7  56.28,76.76 90 top
C8  36.2,83.65 90 top
C10  60.17,83.57 90 top
C11  30.56,70.63 270 bottom
C12  27.38,76.35 270 bottom
C13  27.38,70.63 270 bottom
C14  30.56,76.35 270 bottom
C15  27.38,81.75 270 bottom
C16  47.94,78.89 90 bottom
C17  58.02,83.36 270 bottom
C18  24.13,46.98 90 bottom
C20  66.99,22.37 270 bottom
C21  77.79,85 270 bottom
D1  73.1,78.26 0 top
D2  73.1,84.3 0 top
D3  52.47,73.1 0 top
D4  73.1,81.28 0 top
F1  66.05,71.6 180 top
F2  66.05,37.23 180 top
F4  24.06,36.04 0 top
F5  66.05,71.6 180 top
F6  66.05,37.31 180 top
F8  24.06,36.04 0 top
IC1  46.91,22.69 0 top
IC2  27.38,81.75 90 top
IC3  67.31,55.55 270 top
IC4  67.31,18.88 270 top
IC5  53.34,63.58 270 top
IC6  43.97,63.58 270 top
IC8  27.38,73.17 90 top
IC9  MC34063A  [SO08']  52.55,78.74 0 top
JP1  28.19,86.04 90 top
JP2  33.02,77.46 270 top
JP3  21.19,83.97 270 top
JP4  21.19,78.89 270 top
JP5  25.4,30.48 270 top
JP6  67.3,83.82 90 top
JP7  24.13,41.91 0 top
JP8  67.3,78.74 90 top
JP9  67.3,81.28 90 top
JP10  21.11,72.93 0 top
L2  44.85,78.99 90 top
LED1  59.77,67.87 90 top
OK1  24.77,11.89 0 top
OK2  24.77,23.32 0 top
OK3  24.77,48.73 0 top
OK4  24.77,60.16 0 top
R1  50.09,84.69 90 top
R2  54.29,84.69 270 top
R3  35.88,7.06 90 top
R4  37.7,7.06 90 top
R5  39.53,7.06 90 top
R6  41.35,7.06 90 top
R8  43.18,7.06 90 top
R9  45.01,7.06 90 top
R10  46.83,7.06 90 top
R11  18.97,81.11 270 top
R12  62.15,44.84 0 top
R13  36.59,76.68 270 top
R14  36.59,73.03 90 top
R15  30.64,33.81 270 top
R16  55.01,7.06 270 top
R17  62.15,42.31 0 top
R18  30.64,37.86 270 top
R19  62.31,29.69 0 top
R20  62.31,32.23 180 top
R21  59.53,73.03 270 top
R22  59.53,76.68 270 top
R23  52.31,84.69 270 top
R24  48.66,7.06 90 top
R25  50.48,7.06 90 top
R26  52.31,7.06 90 top
R27  59.77,63.66 90 top
RN1  19.05,18.25 270 top
RN2  30.48,18.26 270 top
RN3  30.48,52.55 90 top
RN7  19.05,52.56 90 top
SV1  12.14,80.41 90 top
SV2  46.91,12.06 0 top
U$1  46.99,38.58 90 top
U$2  46.99,51.28 90 top
U$3  85.33,77.39 0 top
X1  81.76,85.17 270 top
X2  81.76,55.17 270 top
X3  10.16,55.17 90 top
X4  10.16,18.73 90 top
X6  6.43,81.51 90 top
X8  81.76,18.73 270 top

### Tracks (layer width: path | path; a pad name or v marks a point on that pad's centre or on a via)
ARS232RX
  Top 0.254: 24.37,72.54 IC8.13 23.02,72.54 22.38,73.17 22.38,75.39 21.19,76.59 JP4.3
ARS232TX
  Top 0.254: IC8.14 25.56,71.27 25.8,71.51 25.8,72.93 25.56,73.17 23.1,73.17 22.86,73.41 22.86,80.32 23.02,80.47 25.56,80.47 25.8,80.71 25.8,81.51 25.56,81.75 22.15,81.75 21.59,82.3 20.64,82.3 JP3.3
CA0  (via drill 0.3 pad 0.76)
  Top 0.254: R3.1 35.88,6.27 v36.2,6.43
  Bottom 0.254: U$1.1 40.64,32.15 35.96,27.46 35.96,9.45 35.96,6.67 v36.2,6.43
CA1  (via drill 0.3 pad 0.76)
  Top 0.254: R4.1 v37.7,6.43
  Bottom 0.254: U$1.3 44.45,33.5 42.62,33.5 36.43,27.3 36.43,9.37 37.7,8.1 v37.7,6.43
CA2  (via drill 0.3 pad 0.76)
  Top 0.254: R5.1 v39.53,6.43
  Bottom 0.254: U$1.10 46.99,41.12 46.99,34.37 45.64,33.02 42.78,33.02 36.91,27.15 36.91,9.53 39.53,6.91 v39.53,6.43
CA3  (via drill 0.3 pad 0.76)
  Top 0.254: R6.1 41.35,6.59 v41.35,6.43
  Bottom 0.254: U$1.7 | U$1.7 52.07,43.66 50.09,43.66 49.61,43.18 49.61,34.45 47.7,32.54 42.94,32.54 37.39,26.99 37.39,9.68 40.16,6.91 40.56,6.91 40.88,6.91 v41.35,6.43
CA4  (via drill 0.3 pad 0.76)
  Top 0.254: v43.18,6.43 R8.1
  Bottom 0.254: U$1.8 | U$1.8 52.15,41.04 52.15,34.45 51.36,33.66 49.53,33.66 47.94,32.07 43.1,32.07 37.86,26.83 37.86,9.84 40.32,7.38 42.23,7.38 v43.18,6.43 | v43.18,6.43
CA5  (via drill 0.3 pad 0.76)
  Top 0.254: R9.1 v45.01,6.43
  Bottom 0.254: U$2.1 39.21,47.47 35.48,43.74 35.48,6.27 35.48,6.11 35.88,5.71 44.29,5.71 v45.01,6.43
CA6  (via drill 0.3 pad 0.76)
  Top 0.254: R10.1 | v46.83,6.43 R10.1
  Bottom 0.254: U$2.3 | U$2.3 44.61,48.58 39.69,48.58 35,43.89 35,5.95 35.72,5.24 45.64,5.24 v46.83,6.43
CA7  (via drill 0.3 pad 0.76)
  Top 0.254: R24.1 | v48.66,6.43 R24.1
  Bottom 0.254: U$2.10 46.83,56.2 53.9,56.2 54.53,55.56 54.53,54.53 49.05,49.05 39.53,49.05 34.53,44.05 34.53,5.79 35.56,4.76 46.99,4.76 v48.66,6.43
CA8  (via drill 0.3 pad 0.76)
  Top 0.254: R25.1 | v50.48,6.43 R25.1
  Bottom 0.254: U$2.7 53.34,54.05 48.82,49.53 39.37,49.53 34.05,44.21 34.05,5.64 35.4,4.29 48.34,4.29 v50.48,6.43
CA9  (via drill 0.3 pad 0.76)
  Top 0.254: v52.31,6.51 R26.1
  Bottom 0.254: U$2.8 50.8,52.23 48.58,50.01 39.21,50.01 33.58,44.37 33.58,5.48 35.24,3.81 50.64,3.81 52.31,5.48 v52.31,6.51
COL0  (via drill 0.3 pad 0.76)
  Top 0.254: R3.2 38.66,10.79 SV2.1 39.29,11.35 38.1,12.54 38.1,13.97 39.29,15.16 39.29,17.86 v38.97,18.18 | IC1.7 39.87,23.44 v39.61,23.18
  Bottom 0.254: v38.97,18.18 | v38.97,18.18 38.73,18.41 38.73,22.3 v39.61,23.18
COL1  (via drill 0.3 pad 0.76)
  Top 0.254: SV2.2 39.29,13.02 40.56,11.75 40.56,9.84 39.85,9.13 38.26,9.13 37.7,8.57 R4.2 | IC1.8 40.4,22.94 v39.61,22.15 | SV2.2 | SV2.2 | SV2.2 39.29,14.45 39.77,14.92 39.77,18.81 v39.45,19.13
  Bottom 0.254: v39.61,22.15 | v39.45,19.13 39.21,19.37 39.21,21.99 39.37,22.15 v39.61,22.15
COL2
  Top 0.254: IC1.15 40.47,19.44 40.24,19.21 40.24,14.21 40.56,13.89 40.56,12.78 41.83,11.51 SV2.3 41.83,10.4 39.53,8.1 R5.2
COL3
  Top 0.254: SV2.4 | SV2.4 40.72,14.45 40.72,18.73 40.83,18.94 IC1.16 | SV2.4 41.83,12.78 43.1,11.51 43.1,10.24 41.35,8.49 R6.2
COL4
  Top 0.254: IC1.17 43.18,14.37 43.08,14.35 43.08,12.8 44.37,11.51 SV2.5 43.18,9.6 R8.2
COL5
  Top 0.254: SV2.6 | IC1.18 43.66,14.04 SV2.6 | SV2.6 44.37,12.78 45.64,11.51 45.64,10.24 45.01,9.6 R9.2 | R9.2 | R9.2
COL6
  Top 0.254: IC1.21 45.16,14.37 45.64,13.89 45.64,12.78 46.91,11.51 SV2.7 | SV2.7 | SV2.7 46.83,10.72 R10.2 | R10.2 | R10.2
COL7
  Top 0.254: SV2.8 | IC1.22 45.66,14.51 SV2.8 | SV2.8 46.91,12.78 48.18,11.51 48.18,10.24 48.66,9.76 R24.2 | R24.2 | R24.2
COL8  (via drill 0.3 pad 0.76)
  Top 0.254: SV2.9 49.45,9.92 50.48,8.89 R25.2 | R25.2 | R25.2 | IC1.31 50.16,17.94 v49.77,18.34
  Bottom 0.254: v49.77,18.34 49.77,16.91 48.18,15.32 48.18,12.62 49.45,11.35 SV2.9
COL9  (via drill 0.3 pad 0.76)
  Top 0.254: SV2.10 49.45,12.86 50.8,11.51 50.8,10.16 52.31,8.65 R26.2 | IC1.32 50.66,17.96 v50.96,18.26
  Bottom 0.254: v50.96,18.26 50.96,17.38 49.45,15.88 49.45,14.45 SV2.10 | SV2.10
DC  (via drill 0.3, 0.3 pad 0.76)
  Top 0.254: IC6.14 43.1,65.48 v42.7,65.09 | IC1.59 45.66,29.75 45.2,30.2 | 45.2,30.2 43.81,31.59 38.89,31.59 35.16,35.32 35.16,55.96 v34.92,56.2 | v45.48,30.16 45.2,30.2
  Bottom 0.254: v34.92,56.2 | v34.92,56.2 34.69,56.44 34.69,57.15 v42.7,65.09 | SV2.12 51.99,16.03 54.77,18.81 54.77,22.15 54.53,22.38 54.53,26.04 52.86,27.7 51.04,27.7 50.64,28.1 50.64,29.45 49.93,30.16 v45.48,30.16
GND  (via drill 0.3, 0.3 pad 0.76)
  Top 0.254: IC1.9 42.69,22.44 v42.94,22.69 | 24.29,83.65 IC2.5 v25.8,83.65 | IC3.19 73.98,49.76 | IC8.8 v28.97,77.62 | IC5.8 v48.66,59.13 | v45.16,63.98 45.4,64.21 IC6.13 | R20.1 v64.37,32.23 | v73.98,12.46 73.93,12.49 | v73.98,49.13 | R22.1 v60.8,77.63 | R18.1 v29.37,38.81 | IC6.8 v43.02,59.13 | U$3.3 82.92,79.64 v82.95,79.69 | R23.1 v52.31,86.6 | 73.98,13.12 IC4.19
  Top 0.305: IC1.25 47.16,18.02 47.15,18.02 46.83,18.34 v46.83,18.32 | v28.97,81.11 IC2.2 | IC1.20 44.66,18.07 v44.93,18.34 | v47.39,27.14 v47.39,27.15 47.16,27.37 IC1.56 | v51.36,23.17 v51.36,23.18 51.59,22.94 IC1.41
  Top 0.61: IC9.4 v54.45,74.69 | C7.1 56.28,74.69 v56.28,74.22 v56.28,73.1 | D3.A v56.28,73.1 | v56.28,73.1 56.28,73.82 | IC8.10 26.1,76.35 v26.11,76.36
  Top 0.813: v22.62,70 IC8.15 | 73.98,49.76 v73.98,49.13 | v52.7,17.78 v56.52,17.78 | v36.27,30 v36.83,29.45 39.05,27.23 v39.45,27.23 v40.24,27.23 | v73.98,12.46 73.98,13.12
  Bottom 0.254: C15.P$1 28.97,83.33 | v28.97,77.62 28.97,77.94 C14.P$1 30.56,79.52 28.97,79.52 v28.97,81.11 | 19.76,83.65 v25.8,83.65 | 86.04,86.9 | 86.04,86.9 86.04,86.91 | 86.04,86.9 | X6.2 X6.1
  Bottom 0.61: v56.28,73.1 56.28,73.82
  pour Bottom (isolate 0.254, rank 2): 0,90 0,75.01 9.92,75.01 18.89,66.04 25.4,66.04 25.4,-0.01 93.03,-0.01 93.03,90
  pour Top (no thermals): 54.13,72.31 54.13,76.76 56.91,76.76 56.91,72.31
GNDA
  Bottom 1.676: X3.10 10.21,70.92 14.05,67.07 14.05,39.37 | X4.10 10.16,34.53 14.05,38.42 14.05,39.37 | JP7.1 | JP7.1 | JP7.1 | JP7.1 21.59,39.37 14.05,39.37 | JP7.1 21.59,43.81 23.18,45.4 24.13,45.4 C18.P$1
I1.0
  Top 0.254: IC1.53 48.66,29.92 45.09,33.5 39.53,33.5 37.07,35.96 37.07,56.99 | OK4.15 29.86,63.33 RN3.9 | 37.07,56.99 | RN3.9 | 37.07,56.99 31.35,62.71 RN3.9
I1.1
  Top 0.254: 36.59,56.83 36.59,35.8 39.37,33.02 44.93,33.02 48.16,29.79 IC1.54 | OK4.13 29.86,60.79 RN3.8 | 36.59,56.83 36.59,56.75 | RN3.8 | 36.59,56.83 33.26,60.17 RN3.8
I1.2
  Top 0.254: IC1.55 47.66,29.65 44.77,32.54 39.21,32.54 36.12,35.64 36.12,53.34 36.12,56.67 35.16,57.63 | OK4.11 29.86,58.25 RN3.7 | 35.16,57.63 | 35.16,57.63 RN3.7 | RN3.7
I1.3
  Top 0.254: IC1.58 46.16,30.52 44.61,32.07 39.05,32.07 35.64,35.48 35.64,56.52 35,57.15 32.54,57.15 RN3.6 | OK4.9 29.86,55.71 RN3.6 | RN3.6 | RN3.6
I1.4
  Top 0.254: 43.66,29.13 IC1.63 | 43.66,29.13 | 43.66,29.13 43.1,29.69 38.26,29.69 33.26,34.69 33.26,49.77 RN3.5 | OK3.15 29.83,51.9 RN3.5 | RN3.5 | RN3.5
I1.5
  Top 0.254: IC1.64 43.16,28.99 42.94,29.21 38.1,29.21 32.78,34.53 32.78,47.7 RN3.4 | OK3.13 29.83,49.36 RN3.4 | RN3.4
I1.6
  Top 0.254: IC1.1 38.81,26.44 32.31,32.94 32.31,45.64 RN3.3 | OK3.11 29.83,46.82 RN3.3 | RN3.3 | RN3.3
I1.7
  Top 0.254: IC1.2 38.67,25.94 31.83,32.78 31.83,43.58 RN3.2 | OK3.9 29.83,44.28 RN3.2 | RN3.2
I2.0
  Top 0.254: OK2.15 29.86,26.5 RN2.2 31.43,25.88 31.87,25.44 IC1.3
I2.1
  Top 0.254: OK2.13 29.86,23.96 RN2.3 32.13,24.94 IC1.4
I2.2
  Top 0.254: OK2.11 29.86,21.42 RN2.4 32.38,20.8 36.04,24.44 IC1.5
I2.3
  Top 0.254: OK2.9 29.86,18.88 RN2.5 36.16,23.94 IC1.6
I2.4
  Top 0.254: IC1.11 41.2,21.43 34.37,21.43 31.59,18.65 31.59,16.83 RN2.6 29.83,15.07 OK1.15
I2.5
  Top 0.254: IC1.12 41.2,20.95 34.53,20.95 32.07,18.49 32.07,14.76 RN2.7 | OK1.13 29.83,12.53 RN2.7 | RN2.7
I2.6
  Top 0.254: IC1.13 41.24,20.44 41.27,20.48 34.77,20.48 32.54,18.26 32.54,12.7 RN2.8 29.83,9.99 OK1.11
I2.7
  Top 0.254: IC1.14 41.26,19.94 41.27,19.92 34.92,19.92 33.02,18.02 33.02,10.64 RN2.9 29.83,7.45 OK1.9
ICSPCLK  (via drill 0.3, 0.3 pad 0.76)
  Top 0.254: v39.21,51.44 38.97,51.67 38.97,52.31 38.5,52.78 38.5,57.55 32.7,63.26 32.7,66.99 32.38,67.39 21.75,67.39 | 21.75,67.39 | 21.75,67.39 14.13,75.01 14.13,82.87 12.14,84.85 SV1.5 | IC1.23 46.16,15.04 v46.35,14.84 | v46.35,14.84 | R16.2 54.13,6.11 v53.74,6.51 53.74,9.05 SV2.11
  Bottom 0.254: v39.21,51.44 39.21,51.51 39.21,51.36 38.34,51.36 37.47,50.48 37.47,49.53 32.62,44.69 32.62,5.16 34.92,2.86 35.4,2.86 50.88,2.86 50.96,2.86 53.74,5.64 v53.74,6.51 53.74,6.91 52.78,7.86 46.59,7.86 45.64,8.81 45.64,13.89 | v39.21,51.44 | 45.64,13.89 | 45.64,13.89 46.35,14.61 v46.35,14.84
ICSPDAT  (via drill 0.3, 0.3 pad 0.76)
  Top 0.254: v38.18,50.16 38.5,50.48 38.5,52.15 38.02,52.63 38.02,57.31 32.23,63.1 32.23,66.28 31.91,66.6 | 31.91,66.6 31.59,66.91 21.83,66.91 21.59,66.91 13.65,74.85 13.65,81.28 13.65,81.44 SV1.4 | IC1.24 46.66,16.05 v47.15,15.56 | R14.1 35.88,71.36 35.88,67.63 v36.12,67.39 | v31.99,66.67 | 31.91,66.6 v31.99,66.67
  Bottom 0.254: v38.18,50.16 38.18,49.61 37.94,49.37 33.1,44.53 33.1,5.79 33.1,5.32 35.08,3.33 50.8,3.33 53.02,5.56 53.02,6.91 52.55,7.38 45.96,7.38 43.1,10.24 43.1,13.89 44.77,15.56 v47.15,15.56 | v31.99,66.67 35.4,66.67 v36.12,67.39
MV1  (via drill 0.3)
  Top 0.254: v29.37,34.77 31.19,34.77 | 31.19,34.77 R15.1 | R18.2 31.19,36.91 31.19,34.77 | IC1.33 55.28,18.94 v55.48,18.73
  Bottom 0.254: v29.37,34.77 31.67,32.46 31.67,4.92 31.67,4.84 34.61,1.91 51.28,1.91 54.93,5.56 54.93,7.14 53.26,8.81 53.26,15.56 53.26,16.51 53.26,16.67 55.32,18.73 v55.48,18.73
MV2  (via drill 0.3)
  Top 0.254: IC1.34 56.59,19.44 v56.91,19.21 | v57.15,25.16 57.15,26.83 60.24,29.92 60.24,31.91 60.56,32.23 | R17.1 60.48,42.31 60.25,42.07 60.24,32.54 60.56,32.23 | 60.56,32.23 R20.2
  Bottom 0.254: v56.91,19.21 56.83,19.21 56.91,19.45 | 56.91,19.45 | 56.91,19.45 56.91,24.92 v57.15,25.16
MV3  (via drill 0.3)
  Top 0.254: IC1.35 55.31,19.94 v55.48,20.16 | v55.48,20.16 | v55.01,31.43 55.01,31.83 55.48,32.31 55.48,54.13 58.26,56.91 58.26,73.26 58.98,73.98 R21.1 R22.2 | R22.2 | R22.2
  Bottom 0.254: v55.48,20.16 55.8,20.16 55.96,20.32 55.96,30.8 55.32,31.43 v55.01,31.43
N$3
  Top 0.254: IC3.36 75.04,61.08 75.33,60.79 74.96,60.43 IC3.35
  Top 0.813: 75.33,60.79 75.49,60.79 75.96,61.27 75.96,65.08 78.29,67.4 81.74,67.4 81.76,67.39 | 81.76,67.39 | 81.76,67.39 X2.2
N$5
  Top 0.254: U$1.12 40.64,43.58 41.99,44.93 41.99,52.55 40.64,53.9 U$2.12 | U$2.12 | U$2.12 43.9,58.42 51.59,58.42 52.07,58.9 52.07,64.77 55.32,68.02 IC5.16 56.44,68.02
N$7
  Top 0.254: U$1.11 43.18,43.66 44.45,44.93 44.45,52.55 43.18,53.82 U$2.11 43.18,55.88 44.77,57.47 51.99,57.47 53.02,58.5 53.02,59.13 53.02,60.24 53.02,63.18 55.32,65.48 IC5.14
N$8
  Top 0.254: U$1.2 43.18,36.04 41.91,37.31 41.91,43.66 43.18,44.93 U$2.2 43.18,52.55 41.91,53.82 41.91,55.56 44.29,57.94 51.83,57.94 52.55,58.66 | 52.55,58.66 | 52.55,58.66 52.55,58.98 52.55,63.9 55.4,66.75 IC5.15 56.44,66.75
N$9
  Top 0.254: U$2.9 48.26,53.9 49.61,52.55 49.61,44.93 48.26,43.58 U$1.9 | U$2.9 | U$2.9 | U$2.9 49.69,56.52 52.31,56.52 53.98,58.18 53.98,59.13 53.98,60.33 53.98,61.59 55.32,62.94 IC5.12 56.44,62.94
N$10
  Top 0.254: U$1.4 48.26,36.04 46.99,37.31 46.99,43.66 48.26,44.93 U$2.4 48.26,52.55 46.99,53.82 46.99,55.64 48.42,56.99 52.15,56.99 53.5,58.34 53.5,60.48 | 53.5,60.48 | 53.5,60.48 53.5,62.39 55.32,64.21 IC5.13
N$11
  Top 0.254: U$1.5 50.8,36.12 49.61,37.31 49.61,43.74 50.8,44.93 U$2.5 50.8,53.18 51.99,54.37 51.99,55.48 52.55,56.04 53.02,56.52 54.45,57.94 54.45,58.58 54.45,60.8 55.32,61.67 IC5.11 56.44,61.67
N$12
  Top 0.254: U$1.6 53.34,36.04 52.07,37.31 52.07,43.66 53.34,44.93 U$2.6 53.34,53.34 54.53,54.53 54.53,57.39 54.93,57.78 54.93,60.01 55.32,60.4 IC5.10 56.44,60.4
N$13
  Top 0.254: IC6.1 40.88,68.02 | IC5.4 48.9,64.21 48.26,63.58 45.8,63.58 45.48,63.26 43.66,63.26 43.34,63.58 39.69,63.58 39.53,63.42 39.53,61.2 39.69,61.04 42.15,61.04 42.47,60.72 42.47,60.09 42.15,59.77 39.61,59.77 38.58,60.8 38.58,66.91 39.69,68.02 IC6.1 | IC6.1 40.96,68.02
N$14
  Top 0.254: IC5.5 51.36,62.94 51.59,62.71 51.59,59.93 51.44,59.77 48.9,59.77 48.26,60.4 IC6.10
N$15
  Top 0.254: IC6.7 39.61,60.4 39.05,60.96 39.05,65.56 39.61,66.12 48.26,66.12 48.9,66.75 IC5.2
N$16
  Top 0.254: IC6.4 43.34,64.21 43.97,64.85 48.26,64.85 48.9,65.48 IC5.3
N$17
  Top 1.676: JP6.1 69.05,84.3 D2.C
N$18
  Top 1.422: 70.9,78.34 D1.C
  Top 1.676: JP8.1 68.97,78.34 70.9,78.34
N$19
  Top 1.422: JP9.1 | JP9.1
  Top 1.676: JP9.1 D4.C
N$20  (via drill 0.3 pad 0.76)
  Top 0.254: v30.64,31.91 R15.2
  Top 0.406: R15.2
  Bottom 0.254: v30.64,31.91 29.21,30.48 JP5.2
N$21
  Top 0.254: R27.2 59.69,64.61 59.77,64.69 LED1.A
N$23
  Top 0.406: RN1.5 20.08,18.25 20.72,18.88 OK2.8 21.59,18.88
N$24
  Top 0.406: RN1.4 20.08,20.79 20.72,21.42 OK2.6 21.59,21.42
N$25
  Top 0.406: RN1.3 20.08,23.32 20.72,23.96 OK2.4 21.59,23.96
N$26
  Top 0.406: RN1.2 20.08,25.86 20.72,26.5 OK2.2 21.59,26.5
N$27
  Top 0.254: IC3.34 74.99,59.78 75.33,59.44 75.01,59.13 IC3.33
  Top 0.813: 75.33,59.44 76.28,59.44 77.23,60.39 77.23,62.77 78.36,63.9 81.75,63.9 81.76,63.9 | 81.76,63.9 | 81.76,63.9 X2.3
N$28
  Top 0.254: IC3.32 75.02,58.48 75.33,58.17 74.98,57.83 IC3.31
  Top 0.813: 75.33,58.17 77.63,58.17 79.84,60.38 81.73,60.38 81.76,60.4 81.76,60.41 X2.4
N$29
  Top 0.254: OK3.8
  Top 0.406: RN7.2 19.7,44.29 OK3.8
N$30
  Top 0.305: IC3.27 75,55.23 75.33,55.55 75,55.88 IC3.28
  Top 0.813: 75.33,55.55 77.23,55.55 79.38,53.4 81.74,53.4 X2.6 | X2.6 | X2.6
N$31
  Top 0.305: IC3.25 74.97,53.93 75.33,54.28 75.03,54.58 IC3.26
  Top 0.813: 75.33,54.28 76.52,54.28 79.36,51.44 79.36,50.57 80.01,49.93 X2.7 | X2.7 | X2.7
N$32
  Top 0.305: IC3.23 75.02,52.63 75.33,52.93 74.98,53.28 IC3.24
  Top 0.813: 75.33,52.93 75.88,52.93 77.87,50.95 77.87,48.33 79.79,46.4 81.73,46.4 81.76,46.43 | 81.76,46.43 | 81.76,46.43 X2.8
N$33
  Top 0.254: 21.51,46.83 OK3.6
  Top 0.406: RN7.3 19.7,46.83 21.51,46.83
N$34
  Top 0.254: 21.51,49.37 OK3.4
  Top 0.406: RN7.4 19.7,49.37 21.51,49.37
N$35
  Top 0.406: 21.59,8.72 OK1.7 20.72,8.72 20.08,9.36 16.75,9.36 13.86,6.47 13.82,6.43 10.16,6.43 X4.2
N$36
  Top 0.406: 21.59,11.26 OK1.5 20.72,11.26 20.08,11.89 15.8,11.89 13.87,9.97 13.84,10 10.16,10 X4.3
N$37
  Top 0.406: 21.59,13.8 OK1.3 20.72,13.8 20.08,14.44 14.84,14.44 13.88,13.47 13.86,13.49 10.16,13.49 X4.4
N$38
  Top 0.406: 21.59,16.34 OK1.1 20.72,16.34 20.07,16.99 X4.5
N$39
  Top 0.254: IC4.36 75.04,24.41 75.33,24.12 74.96,23.75 IC4.35
  Top 0.813: 75.33,24.12 76.12,24.91 76.12,27.21 79.88,30.97 81.74,30.97 81.76,30.96 X8.2
N$40
  Top 0.254: IC4.34 74.99,23.11 75.33,22.77 75.01,22.45 IC4.33
  Top 0.813: 75.33,22.77 75.96,22.77 77.47,24.28 77.47,25.07 79.87,27.47 81.75,27.47 81.76,27.46 X8.3
N$41
  Top 0.254: IC4.32 75.02,21.8 75.33,21.5 74.98,21.16 IC4.31
  Top 0.813: 75.33,21.5 76.75,21.5 79.23,23.97 X8.4
N$42
  Top 0.254: IC4.30 74.97,20.5 75.33,20.15 75.03,19.86 IC4.29
  Top 0.813: 75.33,20.15 77.87,20.15 78.19,20.47 81.75,20.47 X8.5
N$43
  Top 0.305: IC4.28 75,19.2 75.33,18.88 75,18.55 IC4.27
  Top 0.813: 75.33,18.88 77.07,18.88 78.98,16.97 81.74,16.97 X8.6
N$44
  Top 0.305: IC4.25 75.05,17.25 75.33,17.53 74.95,17.91 IC4.26
  Top 0.813: 75.33,17.53 76.52,17.53 79.28,14.76 79.28,14.06 79.85,13.49 81.76,13.49 X8.7
N$45
  Top 0.305: IC4.23 75.02,15.96 75.33,16.26 74.98,16.61 IC4.24
  Top 0.813: 75.33,16.26 75.8,16.26 77.87,14.2 77.87,11.97 79.87,9.97 81.73,9.97 81.76,10 X8.8
N$46
  Top 0.305: IC4.21 75.07,14.65 75.33,14.91 74.93,15.3 IC4.22
  Top 0.813: 75.33,14.91 76.44,13.8 76.44,9.91 79.88,6.47 81.72,6.47 81.76,6.51 X8.9
N$47
  Top 0.305: IC3.22 75.01,51.98 75.33,51.66 | IC3.21 75.15,51.33 75.41,51.58
  Top 0.813: 75.33,51.66 75.41,51.58 76.6,50.39 76.6,45.79 79.48,42.9 81.72,42.9 81.76,42.86 | 81.76,42.86 | 81.76,42.86 X2.9
N$48  (via drill 0.3 pad 0.76)
  Top 0.254: v45.56,59.13 IC6.9 | R27.1 58.98,61.91 v58.98,61.59
  Bottom 0.254: v45.56,59.13 45.56,59.77 46.12,60.33 57.71,60.33 v58.98,61.59
N$50
  Top 0.254: IC6.2 43.34,66.75 43.97,67.39 48.26,67.39 48.9,68.02 IC5.1
N$53  (via drill 0.3 pad 0.76)
  Top 0.254: R14.2 37.63,73.97 41.2,70.41 v43.74,70.41 | R14.2 R13.2 | R14.2 | v59.05,70.41 61.67,70.41 62.94,69.14 73.34,69.14 79.38,75.17 81.04,75.17 81.04,75.15 U$3.1
  Bottom 0.254: v43.74,70.41 v59.05,70.41
N$54  (via drill 0.3)
  Top 0.254: IC3.20 75.04,50.68 75.49,50.24 v75.49,44.85 | R12.2 v64.37,44.85
  Bottom 0.254: v64.37,44.85 v75.49,44.85
N$55
  Top 0.254: IC6.5 43.34,62.94 43.97,62.31 48.26,62.31 48.9,61.67 IC5.6
N$56
  Top 0.254: IC6.6 43.34,61.67 43.97,61.04 48.26,61.04 48.9,60.4 IC5.7
N$57  (via drill 0.3, 0.3 pad 0.76)
  Top 0.254: IC6.15 48.26,66.75 48.9,67.39 53.82,67.39 55.09,68.66 57.63,68.66 57.78,68.5 57.78,57.07 55.01,54.29 55.01,32.46 54.69,32.15 v54.29,32.15 | R16.1 55.01,8.81 56.04,9.92 56.04,11.83 v55.72,12.14
  Bottom 0.254: v54.29,32.15 55.24,32.15 56.44,30.96 56.44,20.8 56.44,20 | 56.44,20 | v55.72,12.14 55.72,13.97 53.82,15.88 53.82,16.59 55.17,17.94 55.64,17.94 56.2,18.49 56.2,19.76 56.44,20
N$58  (via drill 0.3)
  Top 0.254: IC4.20 72.83,14.01 72.23,14.61 v72.23,29.69 | v64.37,29.69 R19.2
  Bottom 0.254: v72.23,29.69 v64.37,29.69
N$59
  Top 0.254: IC9.3 53.18,77.39 53.5,77.71 55.88,77.71 C7.2 | C7.2
N$60
  Top 0.254: F5.2 F1.2 63.02,72.08 R21.2 | R1.2 50.56,85.64 51.2,85.01 51.2,83.03 51.44,82.79 52.94,82.79 53.18,82.55 IC9.6 | 61.59,79.3
  Top 1.422: IC9.6 53.18,79.3 60.17,79.3 | 60.17,79.3 61.59,79.3 63.74,79.3 | 63.74,79.3 60.17,79.3 | 60.17,79.3 C10.+ | F1.2 63.74,71.58 63.74,79.3
  Bottom 1.422: C17.P$2 58.02,81.76 60.16,81.76 C10.+
N$61
  Top 0.254: IC9.7 51.91,81.36 50.64,81.36 IC9.8 | IC9.1 IC9.8 | R1.1 50.48,83.74 50.64,83.74 IC9.8
N$62
  Top 0.61: D3.C 50.24,73.1 | IC9.2 51.91,73.1 D3.C | D3.C 44.85,73.1 L2.1
N$63
  Top 0.61: IC9.5 54.45,83.74 R2.2 | R23.2 | R23.2 | R2.2 | R23.2 R2.2
N$64
  Top 0.254: RN7.1
  Top 0.406: 19.05,42.39 RN7.1 20.16,43.5 22.54,43.5 JP7.2 | JP7.2
  Bottom 0.406: RN1.1 24.13,33.48 JP7.2 | JP7.2
N$66
  Top 0.254: 21.51,51.91 OK3.2
  Top 0.406: RN7.5 19.7,51.91 21.51,51.91
N$67
  Top 0.254: OK4.8
  Top 0.406: RN7.6 19.67,55.72 OK4.8
N$68
  Top 0.254: 21.51,58.26 OK4.6
  Top 0.406: RN7.7 19.67,58.26 21.51,58.26
N$69
  Top 0.254: 21.51,60.8 OK4.4
  Top 0.406: RN7.8 19.67,60.8 21.51,60.8
N$71
  Top 0.254: 21.51,63.34 OK4.2
  Top 0.406: RN7.9 19.67,63.34 21.51,63.34
N$72
  Top 0.406: 21.91,36.04 | 21.91,36.04 F8.1 | F4.1 21.91,36.04 | 21.91,36.04
  Bottom 1.016: 7.86,32.7 12.38,32.7
  Bottom 1.676: JP6.2 66.04,86.92 64.85,88.09 64.85,88.11 | F4.1 | F4.1 | 7.86,32.7 6.42,32.69 2.14,32.69 2.14,88.09 4.45,88.09 64.84,88.09 64.85,88.11 | 12.38,32.7 18.17,32.69 F4.1 | 64.85,88.11
N$73
  Top 0.254: IC3.30 74.97,57.18 75.33,56.82 75.03,56.53 IC3.29
  Top 0.813: 75.33,56.82 78.34,56.82 78.43,56.9 81.75,56.9 X2.5 | X2.5 | X2.5
N$74  (via drill 0.3 pad 0.76)
  Top 0.406: IC8.5 29.29,73.81 v28.97,74.12
  Bottom 0.406: C12.P$1 | v28.97,74.12 28.97,76.35 C12.P$1
N$76  (via drill 0.3 pad 0.76)
  Top 0.406: IC8.4 29.05,72.54 v28.97,72.46
  Bottom 0.406: C12.P$2 27.38,74.52 28.97,72.93 v28.97,72.46
N$77  (via drill 0.3 pad 0.76)
  Top 0.254: v28.97,71.11 29.13,71.27
  Top 0.406: IC8.3 29.77,71.27 29.13,71.27
  Bottom 0.254: 30.08,72.22 C11.P$1
  Bottom 0.406: v28.97,71.11 30.08,72.22
N$80  (via drill 0.3 pad 0.76)
  Top 0.406: IC8.1 v28.97,68.73
  Bottom 0.406: v28.97,68.73 29.29,69.05 C11.P$2
N$81  (via drill 0.3 pad 0.76)
  Top 0.406: v28.97,70 IC8.2
  Bottom 0.254: C13.P$2 28.02,69.05
  Bottom 0.406: 28.02,69.05 v28.97,70
N$82  (via drill 0.3 pad 0.76)
  Top 0.406: IC8.6 31.59,75.08 v31.91,74.76
  Bottom 0.406: v31.91,74.76 C14.P$2
N$85  (1 unrouted)
  Top 1.676: JP8.2 66.03,77.72 68.1,75.72 76.83,75.72 78.5,77.39 83.9,77.39 86.2,75.09 86.2,37.07 68.75,37.07 F2.1
N$86
  Top 0.406: 21.59,27.77 OK2.1 20.72,27.77 20.08,27.14 18.02,27.14 14.18,30.97 14.17,30.96 10.13,30.96 | 10.13,30.96 10.08,30.96 | 10.13,30.96 X4.9
N$87
  Top 0.406: 21.59,25.23 OK2.3 20.72,25.23 20.08,24.59 17.07,24.59 14.19,27.47 14.18,27.46 10.16,27.46 X4.8
N$88
  Top 0.406: 21.59,22.69 OK2.5 20.72,22.69 20.08,22.05 16.11,22.05 14.2,23.97 X4.7
N$89
  Top 0.406: 21.59,20.15 OK2.7 20.72,20.15 20.08,19.52 15.16,19.52 14.2,20.47 14.05,20.48 X4.6
N$90
  Top 1.676: X6.6 X6.5 11.75,88.09 24.86,88.09 26.91,86.04 JP1.2
N$98
  Top 0.254: F5.1 F1.1
  Top 1.422: 68.58,71.58 F1.1 F5.1
  Bottom 1.676: JP9.2 65.41,81.28 63.9,79.77 63.9,76.28 F1.1
N$99  (via drill 0.3 pad 0.76)
  Top 1.422: X1.2 | D4.A | D4.A 75.33,81.28
  Top 1.676: 75.3,83.42 D2.A | D1.A D4.A 75.3,83.42 | 75.3,83.42 v77.79,83.42 X1.2
  Bottom 0.254: v77.79,83.42 C21.P$2
N$100
  Top 0.406: 21.59,45.55 OK3.7 20.72,45.55 20.08,46.19 16.91,46.19 13.63,42.9 10.16,42.9 X3.2 | X3.2 10.16,42.94 | X3.2
N$101
  Top 0.406: 21.59,64.6 OK4.1 20.72,64.6 20.08,63.97 17.78,63.97 14.34,67.4 10.16,67.4 | X3.9 10.16,67.4 | X3.9 | 10.16,67.4 10.16,67.39
N$102
  Top 0.406: 21.59,62.06 OK4.3 20.72,62.06 20.08,61.42 16.83,61.42 14.35,63.9 10.16,63.9 | X3.8 10.16,63.9 | X3.8 | 10.16,63.9
N$103
  Top 0.406: 21.59,48.09 OK3.5 20.72,48.09 20.08,48.73 15.95,48.73 13.63,46.4 10.16,46.4 | X3.3 10.16,46.4 | X3.3 | 10.16,46.4 10.16,46.35
N$104
  Top 0.406: 21.59,59.52 OK4.5 20.72,59.52 20.08,58.88 15.88,58.88 14.36,60.4 10.16,60.4 X3.7 | X3.7
N$105
  Top 0.406: 21.59,50.63 OK3.3 20.72,50.63 20.08,51.27 15,51.27 13.64,49.9 10.16,49.9 X3.4 | X3.4 | X3.4
N$106
  Top 0.406: 21.59,53.17 OK3.1 20.72,53.17 20.09,53.8 13.88,53.8 13.49,53.42 X3.5 | X3.5 | X3.5
N$107
  Top 0.406: OK4.7 20.72,56.98 20.08,56.34 14.92,56.34 14.36,56.9 10.16,56.9 X3.6 | X3.6
N$108
  Top 0.406: RN1.9 20.08,8.09 20.72,7.45 OK1.8 21.59,7.45
N$109
  Top 0.406: RN1.8 20.08,10.62 20.72,9.99 OK1.6 21.59,9.99
N$110
  Top 0.406: RN1.7 20.08,13.16 20.72,12.53 OK1.4 21.59,12.53
N$111
  Top 0.406: RN1.6 20.08,15.71 20.72,15.07 OK1.2 21.59,15.07
N$116
  Top 0.254: R11.2 18.97,73.81 JP10.1
O1.0
  Top 0.254: IC3.6 59.81,57.83 55.96,53.98 55.96,31.35 55.24,30.64 50.32,30.64 49.16,29.48 IC1.52
O1.1
  Top 0.254: IC3.7 59.8,57.18 56.44,53.82 56.44,31.19 55.4,30.16 50.48,30.16 49.66,29.34 IC1.51
O1.2
  Top 0.254: IC3.8 59.78,56.53 56.91,53.66 56.91,31.04 55.56,29.69 50.64,29.69 50.16,29.21 IC1.50
O1.3
  Top 0.254: IC3.9 59.77,55.88 57.39,53.5 57.39,30.88 55.72,29.21 50.8,29.21 50.66,29.07 IC1.49
O1.4
  Top 0.254: IC3.10 59.75,55.23 57.86,53.34 57.86,30.72 53.59,26.44 IC1.48
O1.5
  Top 0.254: IC3.11 59.74,54.58 58.34,53.18 58.34,30.56 53.72,25.94 IC1.47
O1.6
  Top 0.254: IC3.12 59.72,53.93 58.82,53.02 58.82,30.4 53.86,25.44 IC1.46
O1.7
  Top 0.254: IC3.13 59.71,53.28 59.29,52.86 59.29,30.24 53.99,24.94 IC1.45
O2.0
  Top 0.254: IC1.44 56.52,24.44 59.77,21.19 60.56,21.19 IC4.6
O2.1
  Top 0.254: IC1.43 56.31,23.94 59.77,20.48 60.56,20.48 60.59,20.5 IC4.7
O2.2
  Top 0.254: IC1.42 56.17,23.44 59.77,19.84 60.64,19.84 60.63,19.86 IC4.8
O2.3
  Top 0.254: IC4.9 60.57,19.2 60.56,19.21 58.42,19.21 56.28,21.35 | IC1.37 53.33,20.94 53.74,21.35 56.28,21.35 | 56.28,21.35
O2.4
  Top 0.254: IC1.30 49.66,16.3 49.93,16.03 57.31,16.03 59.85,18.57 60.64,18.57 60.62,18.55 IC4.10
O2.5
  Top 0.254: IC1.29 49.16,16.16 49.77,15.56 57.47,15.56 59.85,17.94 60.64,17.94 IC4.11
O2.6
  Top 0.254: IC1.28 48.66,16.03 49.61,15.08 57.63,15.08 59.77,17.22 60.64,17.22 IC4.12
O2.7
  Top 0.254: IC1.27 48.16,15.89 49.45,14.61 57.78,14.61 59.77,16.59 60.56,16.59 60.58,16.61 IC4.13
RS232RX#
  Top 0.254: IC8.12 26.11,73.81 28.02,75.71 33.1,75.71 33.02,75.87 JP2.3
RS485A  (via drill 0.3)
  Top 0.254: IC2.6 23.18,82.38 22.78,82.78 22.78,85 22.45,85.33 JP3.1 JP3.2 | R11.1 v18.97,83.03 18.97,83.09 19.76,83.97 JP3.2 | JP3.2
  Bottom 0.254: X6.3 8.16,81.51 10.87,84.22 17.78,84.22 v18.97,83.03
RS485B
  Top 0.254: IC2.7 22.86,81.11 22.7,81.11 22.38,81.11 21.68,80.41 JP4.1 | JP4.1 JP4.2 20.32,78.89 20.32,78.9 20.08,78.66 20.08,74.77 20.64,74.22 JP10.2 | JP4.1 | JP4.1
  Bottom 0.254: X6.4 5.17,81.51 6.43,80.25 9.13,80.25 10.24,79.14 13.41,79.14 18.34,74.22 JP10.2
RS485RX  (via drill 0.3)
  Top 0.254: JP2.2 33.81,77.46 33.97,77.31 34.45,76.83 34.45,63.5 v34.21,63.18 | JP2.2 | JP2.2 JP2.1 33.02,79.52 32.7,79.84 IC2.1 | IC1.62 44.16,29.26 43.26,30.16 38.42,30.16 33.73,34.85 33.73,52.94 v33.5,53.18
  Bottom 0.254: v33.5,53.18 | v33.5,53.18 33.18,53.5 33.18,61.83 34.21,62.87 v34.21,63.18
RS485TE  (via drill 0.3)
  Top 0.254: 30.48,82.38 IC2.3 31.76,82.38 34.92,79.22 34.92,62.23 v35.08,62.07 | IC1.60 45.16,29.53 43.58,31.11 38.73,31.11 34.69,35.16 34.69,54.93 v34.45,55.17
  Bottom 0.254: v34.45,55.17 34.21,55.4 34.21,61.28 34.21,61.59 34.69,62.07 v35.08,62.07
RS485TX  (via drill 0.3)
  Top 0.254: 35.4,79.44 31.19,83.65 30.48,83.65 | IC8.11 26.11,75.08 27.7,76.67 27.7,82.14 29.21,83.65 30.48,83.65 | 30.48,83.65 IC2.4 | IC1.61 44.66,29.4 43.42,30.64 38.58,30.64 34.21,35.01 34.21,53.98 v33.97,54.21 | v35.72,63.74 35.4,64.06 35.4,79.44 | 35.4,79.44 35.4,79.45
  Bottom 0.254: v33.97,54.21 33.66,54.53 33.66,61.67 v35.72,63.74
STATUS1  (via drill 0.3)
  Top 0.254: v55.24,25.16 55.24,25.56 59.77,30.08 59.77,44.13 60.48,44.84 R12.1 61.28,44.85 61.12,45.24 R12.1 | IC1.40 54.98,22.44 v55.24,22.7
  Bottom 0.254: v55.24,25.16 55.48,24.92 55.48,22.94 55.32,22.7 v55.24,22.7
STATUS2  (via drill 0.3)
  Top 0.254: IC1.39 56.39,21.94 57.39,20.95 v57.63,20.95 | v57.63,24.29 57.86,24.53 57.86,26.91 60.64,29.69 60.96,29.69 R19.1
  Bottom 0.254: v57.63,20.95 | v57.63,20.95 57.39,21.19 57.39,24.05 v57.63,24.29
VCC  (via drill 0.3, 0.3 pad 0.76)
  Top 0.254: IC2.8 25.72,79.84 v25.8,79.76 | 47.66,17.89 48.42,18.65
  Top 0.305: IC1.38 50.73,21.44 50.72,21.43 | IC1.19 44.16,18.39 | IC1.26 47.66,17.89 | 46.66,26.05 IC1.57 | IC1.10 44.26,21.94
  Bottom 0.254: C6.P$2 24.84,68.81 C6.P$2 | C16.P$2 v47.94,81.82
  Bottom 0.406: v25.8,79.76 26.99,79.76 C15.P$2
  Bottom 0.813: v22.62,68.81 24.84,68.81 | C1.P$2 v48.66,19.92 | C2.P$2 45.16,27.86 v45.16,27.15 | C4.P$2 49.21,27.78 v49.21,27.07 | C3.P$2 48.66,68.1 v48.66,68.9 | v56.52,16.75 56.52,15.88 v56.52,13.81 | C5.P$2 v58.5,8.41 | v58.5,8.41 | v36.35,66.36 v36.35,65.56 v33.58,65.56 v30.88,65.56 v30.88,64.69 | v52.23,31.43 v52.23,28.42 v51.44,28.42 v51.44,31.43 | v42.7,38.81 v42.7,39.61 v41.12,39.61 v41.12,38.81 | v42.7,38.81 v41.12,38.81 | v42.7,38.81 v41.12,38.81 | v42.7,38.81 v42.7,38.02 v41.12,38.02 v41.12,38.81 | v38.58,16.27 v38.58,15.48 v41.51,15.48 v41.51,16.27 v38.58,16.27
  Bottom 1.016: SV1.2 13.41,77.87 v17.22,74.06 17.22,69.61 v18.03,68.81 v22.62,68.81
  pour Top (isolate 0.254, rank 2): 1.19,90 69.69,90 69.69,-0.01 18.49,-0.01 18.49,5.16 25.4,5.16 25.4,33.58 28.18,33.58 28.18,43.34 25.4,43.34 25.4,66.04 18.89,66.04 9.92,75.01 1.19,75.01
VEE1  (via drill 0.3)
  Top 0.254: IC3.1 67.28,61.08 67.31,61.11 | IC4.1 67.28,24.41 67.31,24.44
  Top 2.184: X2.10 75.28,39.42 70.25,44.45 | X8.10 79.57,2.98 71.04,11.51
  Top 2.54: 67.31,48.88 67.31,48.73 | IC3.M@1 67.31,55.71 | IC3.M@1 IC3.M@3 67.31,48.88 | IC3.M@2 67.31,61.11 IC3.M@1 | 67.31,48.88 | 67.31,25.23 IC4.M@2 67.31,24.44 IC4.M@1 IC4.M@3 76.4,3.13
  Bottom 0.813: C20.P$2 66.98,20.94 v66.99,20
  pour Top (isolate 0.813, no thermals): 72.39,67.14 61.91,67.14 61.91,46.82 72.39,46.82
  pour Top (isolate 0.813): 72.39,46.82 72.39,41.75 66.52,41.75 66.52,32.54 72.55,32.54 72.55,27.93 61.91,27.85 61.91,46.82
  pour Top (isolate 0.813, no thermals): 72.63,27.94 72.63,11.19 78.74,5.08 78.74,0 61.91,0 61.91,27.94
VEE3
  Top 0.406: F8.2 | F8.2 | F4.2 F8.2 | F8.2
  Top 1.676: X4.1 10.16,2.94 2.22,2.94 2.14,39.42 X3.1 25.45,39.42 26.67,40.64 JP7.3 | JP7.3
  Bottom 1.676: F4.2 | F4.2 25.71,36.04 25.71,32.69 24.13,31.11 JP5.1 | F4.2 | JP7.3 26.67,41.51 | JP7.3 26.67,47.15 25.24,48.58 C18.P$2 | JP7.3 | JP7.3 26.67,39.45 26.64,39.42 26.64,36.08 F4.2 | F4.2 | F4.2
~MCLR  (via drill 0.3, 0.3 pad 0.76)
  Top 0.254: IC1.36 51.32,20.44 v51.12,20.24 | SV1.1 12.54,75.33 21.43,66.44 31.27,66.44 31.75,65.96 31.75,62.94 37.54,57.15 37.54,52.07 v37.78,51.83
  Bottom 0.254: v37.78,51.83 37.78,51.67 36.99,50.88 36.99,49.77 32.15,44.93 32.15,5 34.77,2.38 51.12,2.38 54.45,5.71 54.45,6.11 54.45,6.91 53.02,8.33 52.63,8.33 50.8,10.16 50.8,16.59 51.67,17.46 51.67,19.68 v51.12,20.24

### Text on the board
Top: sautter.com